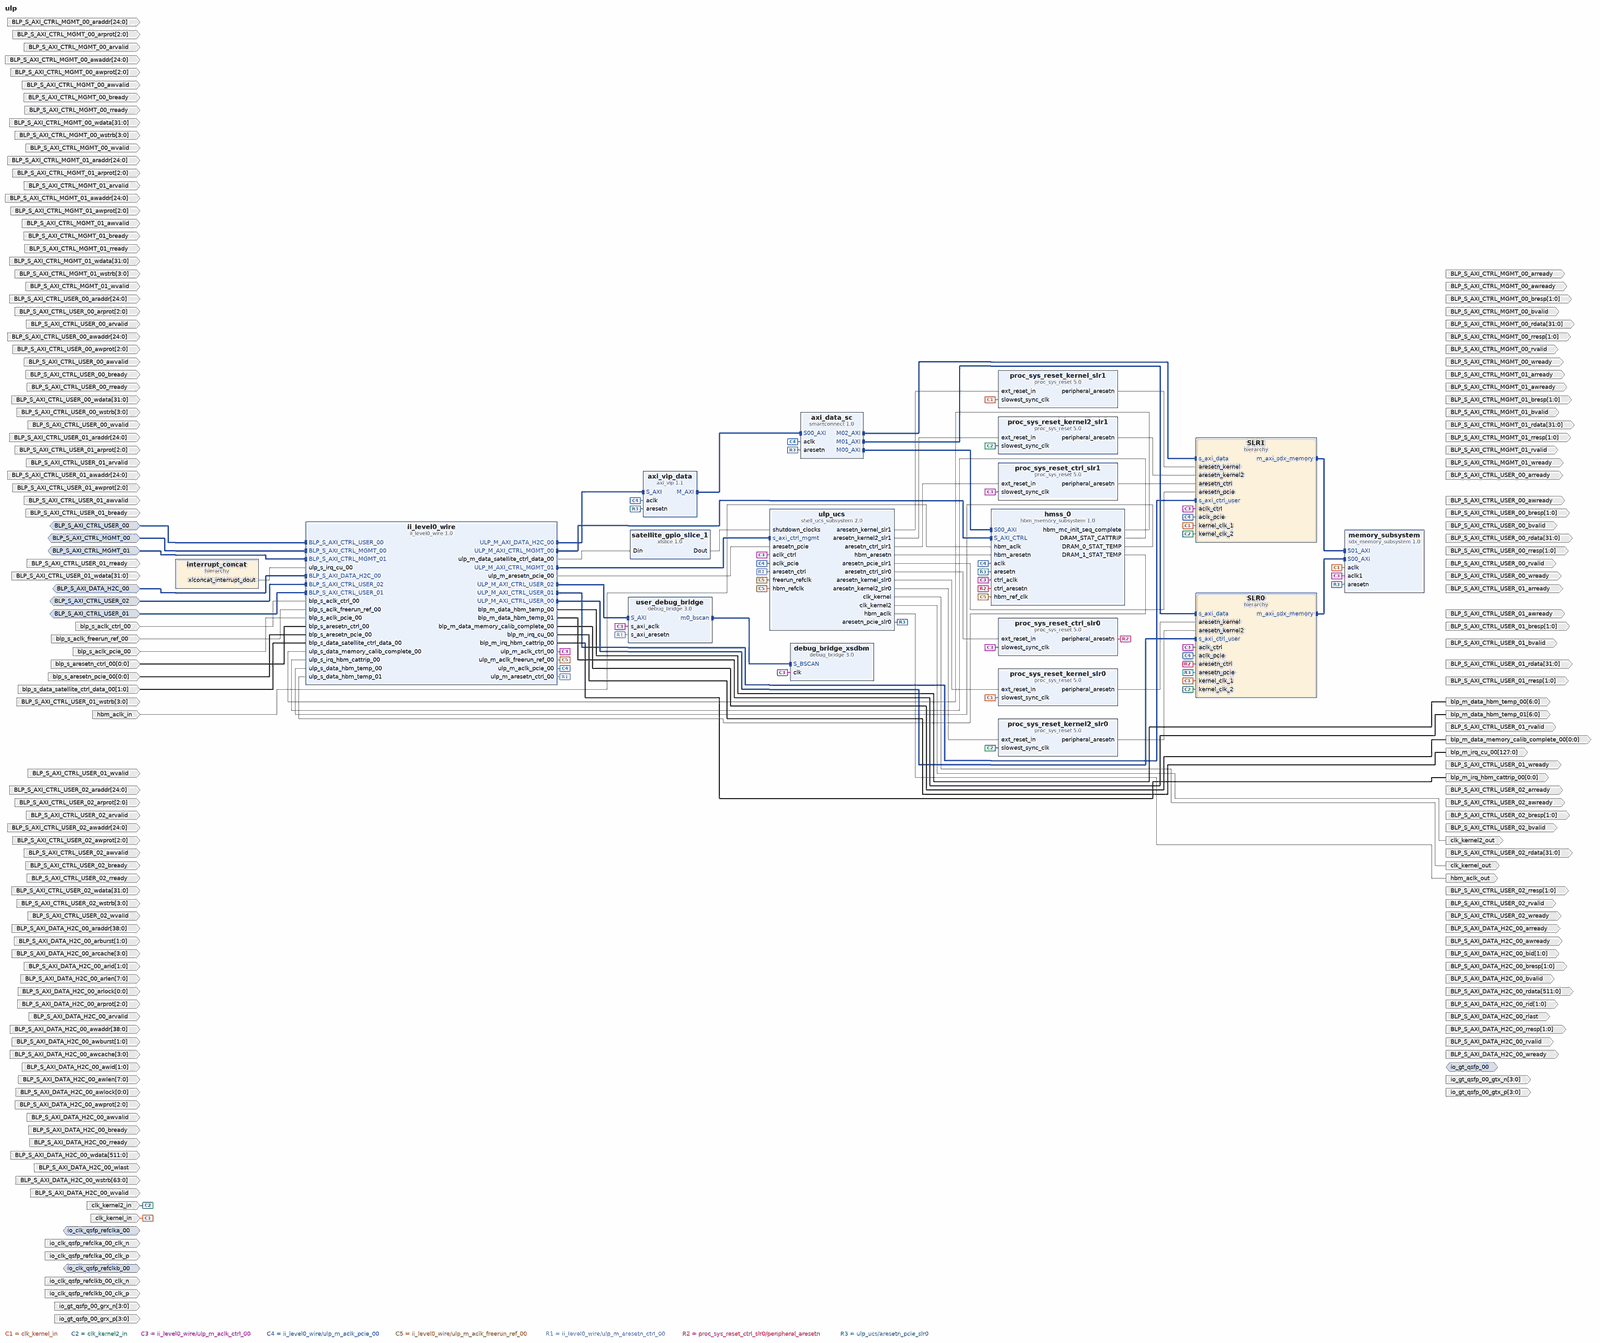
[diagram p0: block diagram of the top level, whole]
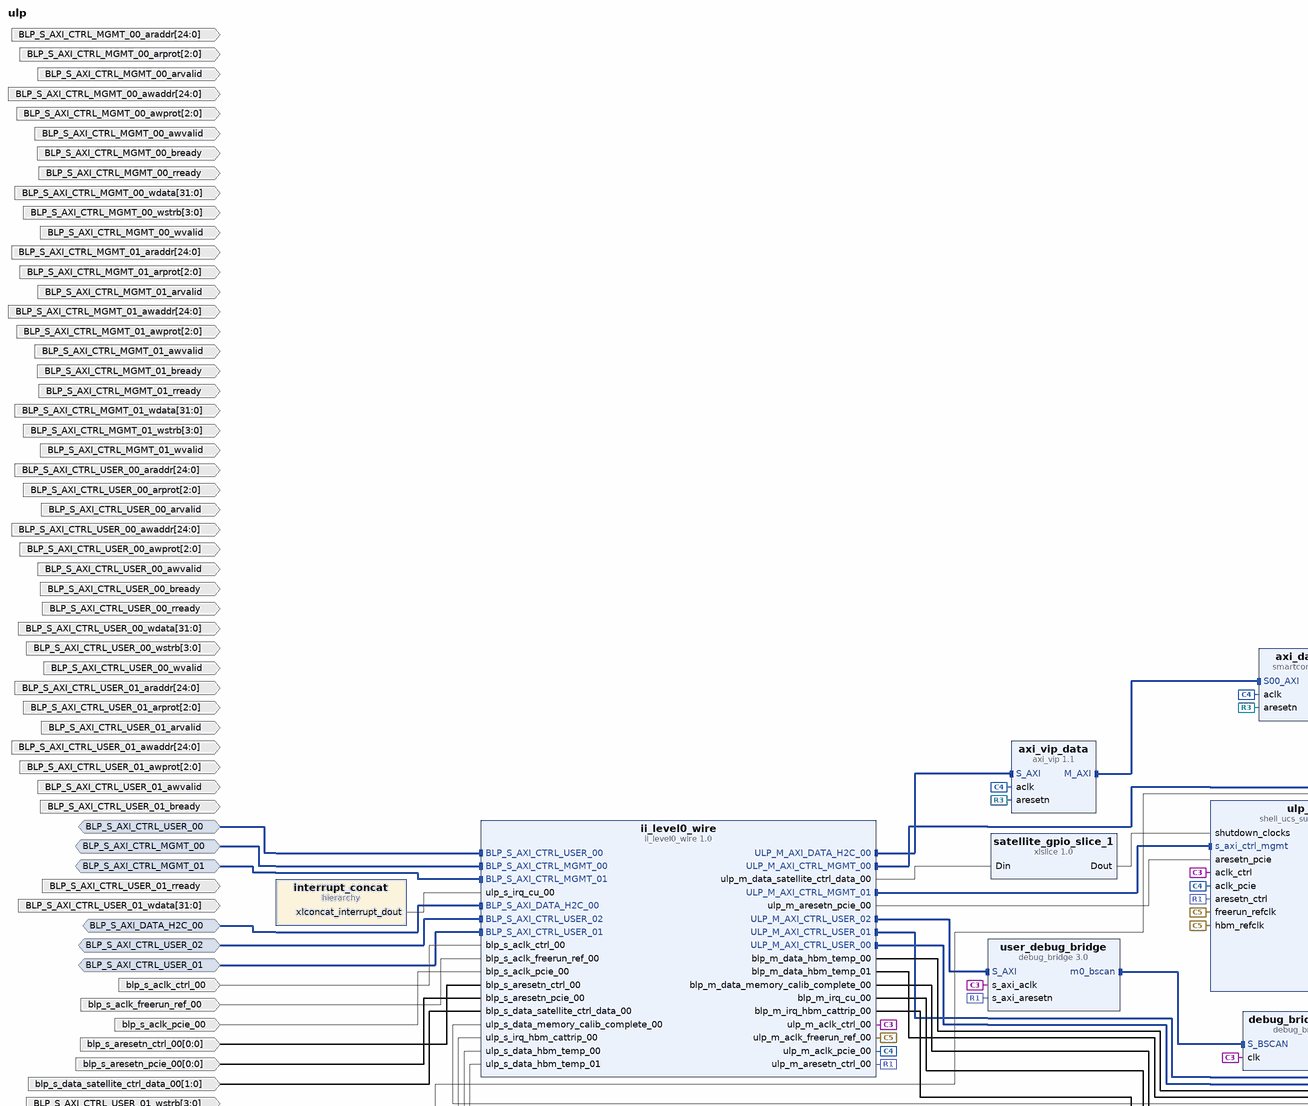
[diagram p1: block diagram of the top level, upper left part]
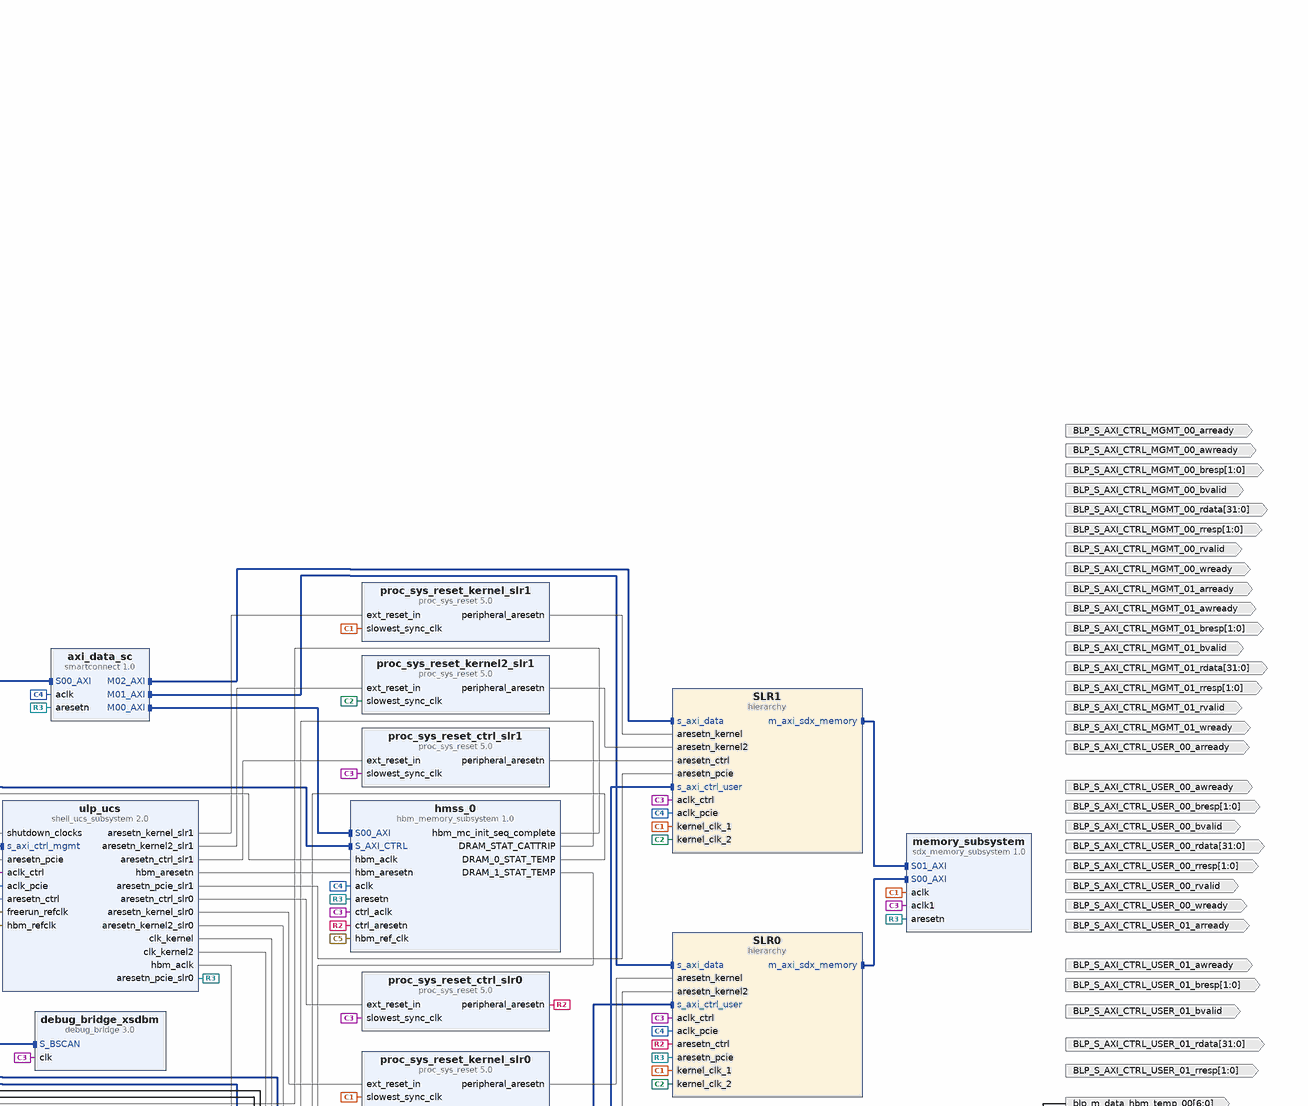
[diagram p2: block diagram of the top level, upper right part]
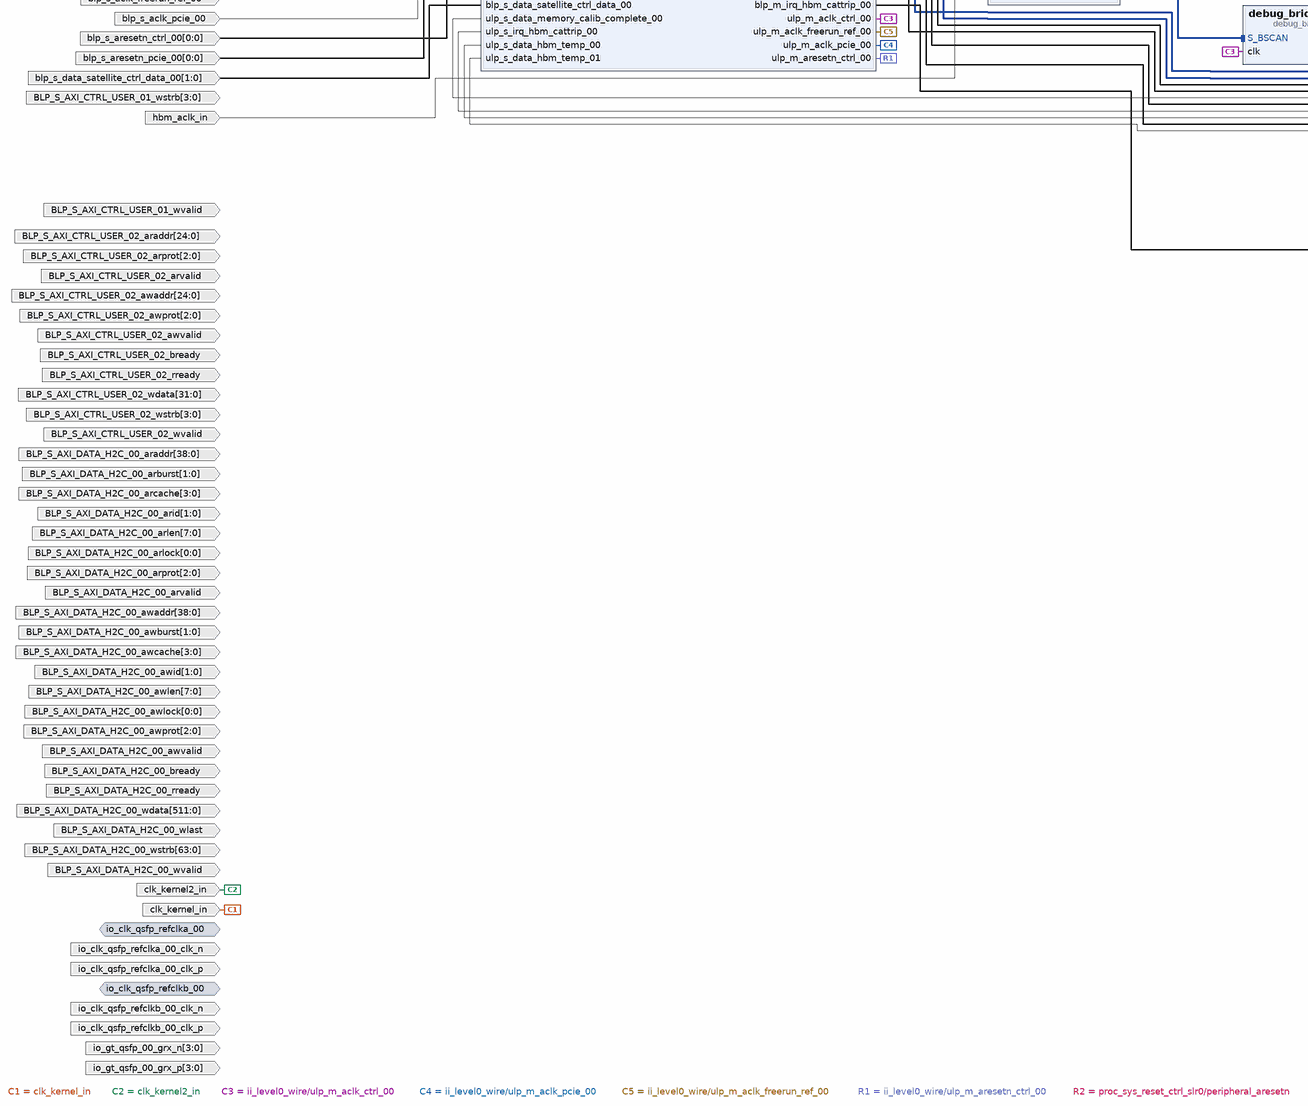
[diagram p3: block diagram of the top level, lower left part]
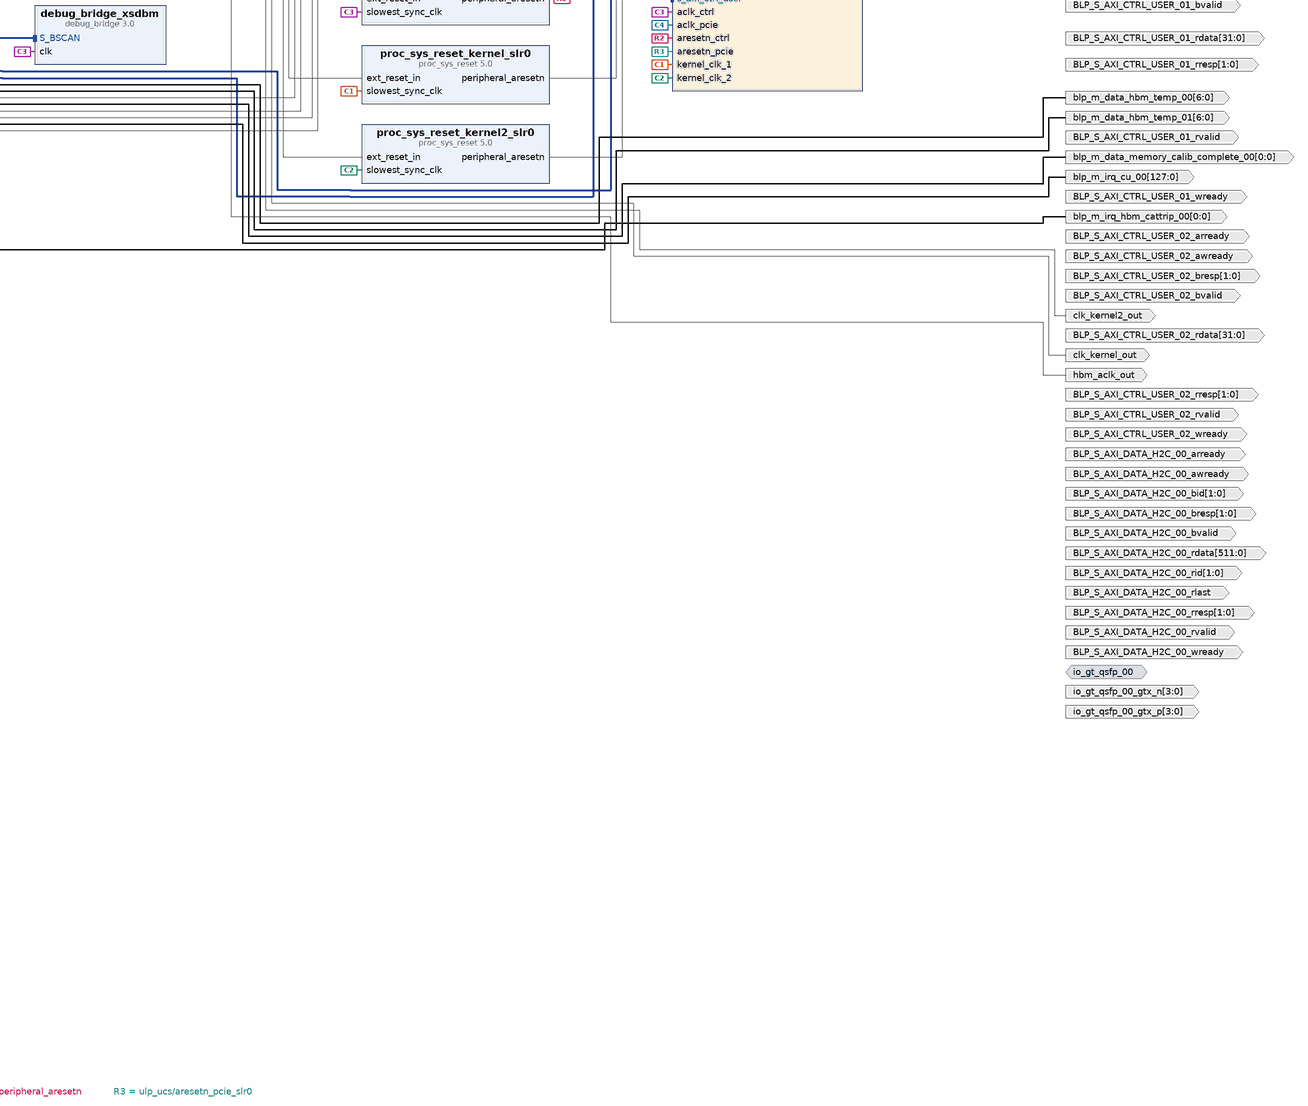
[diagram p4: block diagram of the top level, lower right part]
# Vivado block design ulp, xcu50-fsvh2104-2-e, Vivado 2019.2
create_bd_design ulp

create_bd_intf_port -mode Master -vlnv xilinx.com:interface:gt_rtl:1.0 io_gt_qsfp_00
create_bd_intf_port -mode Slave -vlnv xilinx.com:interface:diff_clock_rtl:1.0 io_clk_qsfp_refclka_00
create_bd_intf_port -mode Slave -vlnv xilinx.com:interface:diff_clock_rtl:1.0 io_clk_qsfp_refclkb_00
create_bd_intf_port -mode Slave -vlnv xilinx.com:interface:aximm_rtl:1.0 BLP_S_AXI_CTRL_MGMT_00
set_property -dict [list \
  CONFIG.DATA_WIDTH 32 \
  CONFIG.PROTOCOL AXI4LITE \
  CONFIG.FREQ_HZ 50000000 \
  CONFIG.ID_WIDTH 0 \
  CONFIG.ADDR_WIDTH 25 \
  CONFIG.AWUSER_WIDTH 0 \
  CONFIG.ARUSER_WIDTH 0 \
  CONFIG.WUSER_WIDTH 0 \
  CONFIG.RUSER_WIDTH 0 \
  CONFIG.BUSER_WIDTH 0 \
  CONFIG.READ_WRITE_MODE READ_WRITE \
  CONFIG.HAS_BURST 0 \
  CONFIG.HAS_LOCK 0 \
  CONFIG.HAS_PROT 1 \
  CONFIG.HAS_CACHE 0 \
  CONFIG.HAS_QOS 0 \
  CONFIG.HAS_REGION 0 \
  CONFIG.HAS_WSTRB 1 \
  CONFIG.HAS_BRESP 1 \
  CONFIG.HAS_RRESP 1 \
  CONFIG.SUPPORTS_NARROW_BURST 0 \
  CONFIG.NUM_READ_OUTSTANDING 2 \
  CONFIG.NUM_WRITE_OUTSTANDING 2 \
  CONFIG.MAX_BURST_LENGTH 1 \
  CONFIG.PHASE 0 \
  CONFIG.CLK_DOMAIN cd_ctrl_00 \
  CONFIG.NUM_READ_THREADS 1 \
  CONFIG.NUM_WRITE_THREADS 1 \
  CONFIG.RUSER_BITS_PER_BYTE 0 \
  CONFIG.WUSER_BITS_PER_BYTE 0 \
] [get_bd_intf_ports BLP_S_AXI_CTRL_MGMT_00]
create_bd_intf_port -mode Slave -vlnv xilinx.com:interface:aximm_rtl:1.0 BLP_S_AXI_CTRL_MGMT_01
set_property -dict [list \
  CONFIG.DATA_WIDTH 32 \
  CONFIG.PROTOCOL AXI4LITE \
  CONFIG.FREQ_HZ 50000000 \
  CONFIG.ID_WIDTH 0 \
  CONFIG.ADDR_WIDTH 25 \
  CONFIG.AWUSER_WIDTH 0 \
  CONFIG.ARUSER_WIDTH 0 \
  CONFIG.WUSER_WIDTH 0 \
  CONFIG.RUSER_WIDTH 0 \
  CONFIG.BUSER_WIDTH 0 \
  CONFIG.READ_WRITE_MODE READ_WRITE \
  CONFIG.HAS_BURST 0 \
  CONFIG.HAS_LOCK 0 \
  CONFIG.HAS_PROT 1 \
  CONFIG.HAS_CACHE 0 \
  CONFIG.HAS_QOS 0 \
  CONFIG.HAS_REGION 0 \
  CONFIG.HAS_WSTRB 1 \
  CONFIG.HAS_BRESP 1 \
  CONFIG.HAS_RRESP 1 \
  CONFIG.SUPPORTS_NARROW_BURST 0 \
  CONFIG.NUM_READ_OUTSTANDING 2 \
  CONFIG.NUM_WRITE_OUTSTANDING 2 \
  CONFIG.MAX_BURST_LENGTH 1 \
  CONFIG.PHASE 0 \
  CONFIG.CLK_DOMAIN cd_ctrl_00 \
  CONFIG.NUM_READ_THREADS 1 \
  CONFIG.NUM_WRITE_THREADS 1 \
  CONFIG.RUSER_BITS_PER_BYTE 0 \
  CONFIG.WUSER_BITS_PER_BYTE 0 \
] [get_bd_intf_ports BLP_S_AXI_CTRL_MGMT_01]
create_bd_intf_port -mode Slave -vlnv xilinx.com:interface:aximm_rtl:1.0 BLP_S_AXI_CTRL_USER_00
set_property -dict [list \
  CONFIG.DATA_WIDTH 32 \
  CONFIG.PROTOCOL AXI4LITE \
  CONFIG.FREQ_HZ 50000000 \
  CONFIG.ID_WIDTH 0 \
  CONFIG.ADDR_WIDTH 25 \
  CONFIG.AWUSER_WIDTH 0 \
  CONFIG.ARUSER_WIDTH 0 \
  CONFIG.WUSER_WIDTH 0 \
  CONFIG.RUSER_WIDTH 0 \
  CONFIG.BUSER_WIDTH 0 \
  CONFIG.READ_WRITE_MODE READ_WRITE \
  CONFIG.HAS_BURST 0 \
  CONFIG.HAS_LOCK 0 \
  CONFIG.HAS_PROT 1 \
  CONFIG.HAS_CACHE 0 \
  CONFIG.HAS_QOS 0 \
  CONFIG.HAS_REGION 0 \
  CONFIG.HAS_WSTRB 1 \
  CONFIG.HAS_BRESP 1 \
  CONFIG.HAS_RRESP 1 \
  CONFIG.SUPPORTS_NARROW_BURST 0 \
  CONFIG.NUM_READ_OUTSTANDING 2 \
  CONFIG.NUM_WRITE_OUTSTANDING 2 \
  CONFIG.MAX_BURST_LENGTH 1 \
  CONFIG.PHASE 0 \
  CONFIG.CLK_DOMAIN cd_ctrl_00 \
  CONFIG.NUM_READ_THREADS 1 \
  CONFIG.NUM_WRITE_THREADS 1 \
  CONFIG.RUSER_BITS_PER_BYTE 0 \
  CONFIG.WUSER_BITS_PER_BYTE 0 \
] [get_bd_intf_ports BLP_S_AXI_CTRL_USER_00]
create_bd_intf_port -mode Slave -vlnv xilinx.com:interface:aximm_rtl:1.0 BLP_S_AXI_CTRL_USER_01
set_property -dict [list \
  CONFIG.DATA_WIDTH 32 \
  CONFIG.PROTOCOL AXI4LITE \
  CONFIG.FREQ_HZ 50000000 \
  CONFIG.ID_WIDTH 0 \
  CONFIG.ADDR_WIDTH 25 \
  CONFIG.AWUSER_WIDTH 0 \
  CONFIG.ARUSER_WIDTH 0 \
  CONFIG.WUSER_WIDTH 0 \
  CONFIG.RUSER_WIDTH 0 \
  CONFIG.BUSER_WIDTH 0 \
  CONFIG.READ_WRITE_MODE READ_WRITE \
  CONFIG.HAS_BURST 0 \
  CONFIG.HAS_LOCK 0 \
  CONFIG.HAS_PROT 1 \
  CONFIG.HAS_CACHE 0 \
  CONFIG.HAS_QOS 0 \
  CONFIG.HAS_REGION 0 \
  CONFIG.HAS_WSTRB 1 \
  CONFIG.HAS_BRESP 1 \
  CONFIG.HAS_RRESP 1 \
  CONFIG.SUPPORTS_NARROW_BURST 0 \
  CONFIG.NUM_READ_OUTSTANDING 2 \
  CONFIG.NUM_WRITE_OUTSTANDING 2 \
  CONFIG.MAX_BURST_LENGTH 1 \
  CONFIG.PHASE 0 \
  CONFIG.CLK_DOMAIN cd_ctrl_00 \
  CONFIG.NUM_READ_THREADS 1 \
  CONFIG.NUM_WRITE_THREADS 1 \
  CONFIG.RUSER_BITS_PER_BYTE 0 \
  CONFIG.WUSER_BITS_PER_BYTE 0 \
] [get_bd_intf_ports BLP_S_AXI_CTRL_USER_01]
create_bd_intf_port -mode Slave -vlnv xilinx.com:interface:aximm_rtl:1.0 BLP_S_AXI_CTRL_USER_02
set_property -dict [list \
  CONFIG.DATA_WIDTH 32 \
  CONFIG.PROTOCOL AXI4LITE \
  CONFIG.FREQ_HZ 50000000 \
  CONFIG.ID_WIDTH 0 \
  CONFIG.ADDR_WIDTH 25 \
  CONFIG.AWUSER_WIDTH 0 \
  CONFIG.ARUSER_WIDTH 0 \
  CONFIG.WUSER_WIDTH 0 \
  CONFIG.RUSER_WIDTH 0 \
  CONFIG.BUSER_WIDTH 0 \
  CONFIG.READ_WRITE_MODE READ_WRITE \
  CONFIG.HAS_BURST 0 \
  CONFIG.HAS_LOCK 0 \
  CONFIG.HAS_PROT 1 \
  CONFIG.HAS_CACHE 0 \
  CONFIG.HAS_QOS 0 \
  CONFIG.HAS_REGION 0 \
  CONFIG.HAS_WSTRB 1 \
  CONFIG.HAS_BRESP 1 \
  CONFIG.HAS_RRESP 1 \
  CONFIG.SUPPORTS_NARROW_BURST 0 \
  CONFIG.NUM_READ_OUTSTANDING 2 \
  CONFIG.NUM_WRITE_OUTSTANDING 2 \
  CONFIG.MAX_BURST_LENGTH 1 \
  CONFIG.PHASE 0 \
  CONFIG.CLK_DOMAIN cd_ctrl_00 \
  CONFIG.NUM_READ_THREADS 1 \
  CONFIG.NUM_WRITE_THREADS 1 \
  CONFIG.RUSER_BITS_PER_BYTE 0 \
  CONFIG.WUSER_BITS_PER_BYTE 0 \
] [get_bd_intf_ports BLP_S_AXI_CTRL_USER_02]
create_bd_intf_port -mode Slave -vlnv xilinx.com:interface:aximm_rtl:1.0 BLP_S_AXI_DATA_H2C_00
set_property -dict [list \
  CONFIG.DATA_WIDTH 512 \
  CONFIG.PROTOCOL AXI4 \
  CONFIG.FREQ_HZ 250000000 \
  CONFIG.ID_WIDTH 2 \
  CONFIG.ADDR_WIDTH 39 \
  CONFIG.AWUSER_WIDTH 0 \
  CONFIG.ARUSER_WIDTH 0 \
  CONFIG.WUSER_WIDTH 0 \
  CONFIG.RUSER_WIDTH 0 \
  CONFIG.BUSER_WIDTH 0 \
  CONFIG.READ_WRITE_MODE READ_WRITE \
  CONFIG.HAS_BURST 1 \
  CONFIG.HAS_LOCK 1 \
  CONFIG.HAS_PROT 1 \
  CONFIG.HAS_CACHE 1 \
  CONFIG.HAS_QOS 0 \
  CONFIG.HAS_REGION 0 \
  CONFIG.HAS_WSTRB 1 \
  CONFIG.HAS_BRESP 1 \
  CONFIG.HAS_RRESP 1 \
  CONFIG.SUPPORTS_NARROW_BURST 0 \
  CONFIG.NUM_READ_OUTSTANDING 16 \
  CONFIG.NUM_WRITE_OUTSTANDING 16 \
  CONFIG.MAX_BURST_LENGTH 256 \
  CONFIG.PHASE 0 \
  CONFIG.CLK_DOMAIN cd_pcie_00 \
  CONFIG.NUM_READ_THREADS 2 \
  CONFIG.NUM_WRITE_THREADS 2 \
  CONFIG.RUSER_BITS_PER_BYTE 0 \
  CONFIG.WUSER_BITS_PER_BYTE 0 \
] [get_bd_intf_ports BLP_S_AXI_DATA_H2C_00]
create_bd_port -dir O -from 3 -to 0 io_gt_qsfp_00_gtx_n
create_bd_port -dir O -from 3 -to 0 io_gt_qsfp_00_gtx_p
create_bd_port -dir I -from 3 -to 0 io_gt_qsfp_00_grx_n
create_bd_port -dir I -from 3 -to 0 io_gt_qsfp_00_grx_p
create_bd_port -dir I io_clk_qsfp_refclka_00_clk_p
create_bd_port -dir I io_clk_qsfp_refclka_00_clk_n
create_bd_port -dir I io_clk_qsfp_refclkb_00_clk_p
create_bd_port -dir I io_clk_qsfp_refclkb_00_clk_n
create_bd_port -dir O -from 6 -to 0 -type data blp_m_data_hbm_temp_00
create_bd_port -dir O -from 6 -to 0 -type data blp_m_data_hbm_temp_01
create_bd_port -dir O -from 0 -to 0 -type data blp_m_data_memory_calib_complete_00
create_bd_port -dir O -from 127 -to 0 -type intr blp_m_irq_cu_00
create_bd_port -dir O -from 0 -to 0 -type intr blp_m_irq_hbm_cattrip_00
create_bd_port -dir I -type clk blp_s_aclk_ctrl_00
set_property -dict {CONFIG.CLK_DOMAIN cd_ctrl_00 CONFIG.FREQ_HZ 50000000 CONFIG.PHASE 0} [get_bd_ports blp_s_aclk_ctrl_00]
create_bd_port -dir I -type clk blp_s_aclk_freerun_ref_00
set_property -dict [list \
  CONFIG.CLK_DOMAIN cd_freerun_ref_00 \
  CONFIG.FREQ_HZ 100000000 \
  CONFIG.PHASE 0 \
] [get_bd_ports blp_s_aclk_freerun_ref_00]
create_bd_port -dir I -type clk blp_s_aclk_pcie_00
set_property -dict {CONFIG.CLK_DOMAIN cd_pcie_00 CONFIG.FREQ_HZ 250000000 CONFIG.PHASE 0} [get_bd_ports blp_s_aclk_pcie_00]
create_bd_port -dir I -from 0 -to 0 -type rst blp_s_aresetn_ctrl_00
create_bd_port -dir I -from 0 -to 0 -type rst blp_s_aresetn_pcie_00
create_bd_port -dir I -from 1 -to 0 -type data blp_s_data_satellite_ctrl_data_00
create_bd_port -dir O -type clk clk_kernel_out
set_property -dict {CONFIG.FREQ_HZ 300000000} [get_bd_ports clk_kernel_out]
create_bd_port -dir O -type clk clk_kernel2_out
set_property -dict {CONFIG.FREQ_HZ 500000000} [get_bd_ports clk_kernel2_out]
create_bd_port -dir I -type clk clk_kernel_in
set_property -dict {CONFIG.FREQ_HZ 300000000} [get_bd_ports clk_kernel_in]
create_bd_port -dir I -type clk clk_kernel2_in
set_property -dict {CONFIG.FREQ_HZ 500000000} [get_bd_ports clk_kernel2_in]
create_bd_port -dir O -type clk hbm_aclk_out
set_property -dict {CONFIG.FREQ_HZ 450000000} [get_bd_ports hbm_aclk_out]
create_bd_port -dir I -type clk hbm_aclk_in
set_property -dict {CONFIG.FREQ_HZ 450000000} [get_bd_ports hbm_aclk_in]
create_bd_port -dir I -from 24 -to 0 BLP_S_AXI_CTRL_MGMT_00_araddr
create_bd_port -dir I -from 2 -to 0 BLP_S_AXI_CTRL_MGMT_00_arprot
create_bd_port -dir O BLP_S_AXI_CTRL_MGMT_00_arready
create_bd_port -dir I BLP_S_AXI_CTRL_MGMT_00_arvalid
create_bd_port -dir I -from 24 -to 0 BLP_S_AXI_CTRL_MGMT_00_awaddr
create_bd_port -dir I -from 2 -to 0 BLP_S_AXI_CTRL_MGMT_00_awprot
create_bd_port -dir O BLP_S_AXI_CTRL_MGMT_00_awready
create_bd_port -dir I BLP_S_AXI_CTRL_MGMT_00_awvalid
create_bd_port -dir I BLP_S_AXI_CTRL_MGMT_00_bready
create_bd_port -dir O -from 1 -to 0 BLP_S_AXI_CTRL_MGMT_00_bresp
create_bd_port -dir O BLP_S_AXI_CTRL_MGMT_00_bvalid
create_bd_port -dir O -from 31 -to 0 BLP_S_AXI_CTRL_MGMT_00_rdata
create_bd_port -dir I BLP_S_AXI_CTRL_MGMT_00_rready
create_bd_port -dir O -from 1 -to 0 BLP_S_AXI_CTRL_MGMT_00_rresp
create_bd_port -dir O BLP_S_AXI_CTRL_MGMT_00_rvalid
create_bd_port -dir I -from 31 -to 0 BLP_S_AXI_CTRL_MGMT_00_wdata
create_bd_port -dir O BLP_S_AXI_CTRL_MGMT_00_wready
create_bd_port -dir I -from 3 -to 0 BLP_S_AXI_CTRL_MGMT_00_wstrb
create_bd_port -dir I BLP_S_AXI_CTRL_MGMT_00_wvalid
create_bd_port -dir I -from 24 -to 0 BLP_S_AXI_CTRL_MGMT_01_araddr
create_bd_port -dir I -from 2 -to 0 BLP_S_AXI_CTRL_MGMT_01_arprot
create_bd_port -dir O BLP_S_AXI_CTRL_MGMT_01_arready
create_bd_port -dir I BLP_S_AXI_CTRL_MGMT_01_arvalid
create_bd_port -dir I -from 24 -to 0 BLP_S_AXI_CTRL_MGMT_01_awaddr
create_bd_port -dir I -from 2 -to 0 BLP_S_AXI_CTRL_MGMT_01_awprot
create_bd_port -dir O BLP_S_AXI_CTRL_MGMT_01_awready
create_bd_port -dir I BLP_S_AXI_CTRL_MGMT_01_awvalid
create_bd_port -dir I BLP_S_AXI_CTRL_MGMT_01_bready
create_bd_port -dir O -from 1 -to 0 BLP_S_AXI_CTRL_MGMT_01_bresp
create_bd_port -dir O BLP_S_AXI_CTRL_MGMT_01_bvalid
create_bd_port -dir O -from 31 -to 0 BLP_S_AXI_CTRL_MGMT_01_rdata
create_bd_port -dir I BLP_S_AXI_CTRL_MGMT_01_rready
create_bd_port -dir O -from 1 -to 0 BLP_S_AXI_CTRL_MGMT_01_rresp
create_bd_port -dir O BLP_S_AXI_CTRL_MGMT_01_rvalid
create_bd_port -dir I -from 31 -to 0 BLP_S_AXI_CTRL_MGMT_01_wdata
create_bd_port -dir O BLP_S_AXI_CTRL_MGMT_01_wready
create_bd_port -dir I -from 3 -to 0 BLP_S_AXI_CTRL_MGMT_01_wstrb
create_bd_port -dir I BLP_S_AXI_CTRL_MGMT_01_wvalid
create_bd_port -dir I -from 24 -to 0 BLP_S_AXI_CTRL_USER_00_araddr
create_bd_port -dir I -from 2 -to 0 BLP_S_AXI_CTRL_USER_00_arprot
create_bd_port -dir O BLP_S_AXI_CTRL_USER_00_arready
create_bd_port -dir I BLP_S_AXI_CTRL_USER_00_arvalid
create_bd_port -dir I -from 24 -to 0 BLP_S_AXI_CTRL_USER_00_awaddr
create_bd_port -dir I -from 2 -to 0 BLP_S_AXI_CTRL_USER_00_awprot
create_bd_port -dir O BLP_S_AXI_CTRL_USER_00_awready
create_bd_port -dir I BLP_S_AXI_CTRL_USER_00_awvalid
create_bd_port -dir I BLP_S_AXI_CTRL_USER_00_bready
create_bd_port -dir O -from 1 -to 0 BLP_S_AXI_CTRL_USER_00_bresp
create_bd_port -dir O BLP_S_AXI_CTRL_USER_00_bvalid
create_bd_port -dir O -from 31 -to 0 BLP_S_AXI_CTRL_USER_00_rdata
create_bd_port -dir I BLP_S_AXI_CTRL_USER_00_rready
create_bd_port -dir O -from 1 -to 0 BLP_S_AXI_CTRL_USER_00_rresp
create_bd_port -dir O BLP_S_AXI_CTRL_USER_00_rvalid
create_bd_port -dir I -from 31 -to 0 BLP_S_AXI_CTRL_USER_00_wdata
create_bd_port -dir O BLP_S_AXI_CTRL_USER_00_wready
create_bd_port -dir I -from 3 -to 0 BLP_S_AXI_CTRL_USER_00_wstrb
create_bd_port -dir I BLP_S_AXI_CTRL_USER_00_wvalid
create_bd_port -dir I -from 24 -to 0 BLP_S_AXI_CTRL_USER_01_araddr
create_bd_port -dir I -from 2 -to 0 BLP_S_AXI_CTRL_USER_01_arprot
create_bd_port -dir O BLP_S_AXI_CTRL_USER_01_arready
create_bd_port -dir I BLP_S_AXI_CTRL_USER_01_arvalid
create_bd_port -dir I -from 24 -to 0 BLP_S_AXI_CTRL_USER_01_awaddr
create_bd_port -dir I -from 2 -to 0 BLP_S_AXI_CTRL_USER_01_awprot
create_bd_port -dir O BLP_S_AXI_CTRL_USER_01_awready
create_bd_port -dir I BLP_S_AXI_CTRL_USER_01_awvalid
create_bd_port -dir I BLP_S_AXI_CTRL_USER_01_bready
create_bd_port -dir O -from 1 -to 0 BLP_S_AXI_CTRL_USER_01_bresp
create_bd_port -dir O BLP_S_AXI_CTRL_USER_01_bvalid
create_bd_port -dir O -from 31 -to 0 BLP_S_AXI_CTRL_USER_01_rdata
create_bd_port -dir I BLP_S_AXI_CTRL_USER_01_rready
create_bd_port -dir O -from 1 -to 0 BLP_S_AXI_CTRL_USER_01_rresp
create_bd_port -dir O BLP_S_AXI_CTRL_USER_01_rvalid
create_bd_port -dir I -from 31 -to 0 BLP_S_AXI_CTRL_USER_01_wdata
create_bd_port -dir O BLP_S_AXI_CTRL_USER_01_wready
create_bd_port -dir I -from 3 -to 0 BLP_S_AXI_CTRL_USER_01_wstrb
create_bd_port -dir I BLP_S_AXI_CTRL_USER_01_wvalid
create_bd_port -dir I -from 24 -to 0 BLP_S_AXI_CTRL_USER_02_araddr
create_bd_port -dir I -from 2 -to 0 BLP_S_AXI_CTRL_USER_02_arprot
create_bd_port -dir O BLP_S_AXI_CTRL_USER_02_arready
create_bd_port -dir I BLP_S_AXI_CTRL_USER_02_arvalid
create_bd_port -dir I -from 24 -to 0 BLP_S_AXI_CTRL_USER_02_awaddr
create_bd_port -dir I -from 2 -to 0 BLP_S_AXI_CTRL_USER_02_awprot
create_bd_port -dir O BLP_S_AXI_CTRL_USER_02_awready
create_bd_port -dir I BLP_S_AXI_CTRL_USER_02_awvalid
create_bd_port -dir I BLP_S_AXI_CTRL_USER_02_bready
create_bd_port -dir O -from 1 -to 0 BLP_S_AXI_CTRL_USER_02_bresp
create_bd_port -dir O BLP_S_AXI_CTRL_USER_02_bvalid
create_bd_port -dir O -from 31 -to 0 BLP_S_AXI_CTRL_USER_02_rdata
create_bd_port -dir I BLP_S_AXI_CTRL_USER_02_rready
create_bd_port -dir O -from 1 -to 0 BLP_S_AXI_CTRL_USER_02_rresp
create_bd_port -dir O BLP_S_AXI_CTRL_USER_02_rvalid
create_bd_port -dir I -from 31 -to 0 BLP_S_AXI_CTRL_USER_02_wdata
create_bd_port -dir O BLP_S_AXI_CTRL_USER_02_wready
create_bd_port -dir I -from 3 -to 0 BLP_S_AXI_CTRL_USER_02_wstrb
create_bd_port -dir I BLP_S_AXI_CTRL_USER_02_wvalid
create_bd_port -dir I -from 38 -to 0 BLP_S_AXI_DATA_H2C_00_araddr
create_bd_port -dir I -from 1 -to 0 BLP_S_AXI_DATA_H2C_00_arburst
create_bd_port -dir I -from 3 -to 0 BLP_S_AXI_DATA_H2C_00_arcache
create_bd_port -dir I -from 7 -to 0 BLP_S_AXI_DATA_H2C_00_arlen
create_bd_port -dir I -from 0 -to 0 BLP_S_AXI_DATA_H2C_00_arlock
create_bd_port -dir I -from 2 -to 0 BLP_S_AXI_DATA_H2C_00_arprot
create_bd_port -dir O BLP_S_AXI_DATA_H2C_00_arready
create_bd_port -dir I BLP_S_AXI_DATA_H2C_00_arvalid
create_bd_port -dir I -from 38 -to 0 BLP_S_AXI_DATA_H2C_00_awaddr
create_bd_port -dir I -from 1 -to 0 BLP_S_AXI_DATA_H2C_00_awburst
create_bd_port -dir I -from 3 -to 0 BLP_S_AXI_DATA_H2C_00_awcache
create_bd_port -dir I -from 7 -to 0 BLP_S_AXI_DATA_H2C_00_awlen
create_bd_port -dir I -from 0 -to 0 BLP_S_AXI_DATA_H2C_00_awlock
create_bd_port -dir I -from 2 -to 0 BLP_S_AXI_DATA_H2C_00_awprot
create_bd_port -dir O BLP_S_AXI_DATA_H2C_00_awready
create_bd_port -dir I BLP_S_AXI_DATA_H2C_00_awvalid
create_bd_port -dir I BLP_S_AXI_DATA_H2C_00_bready
create_bd_port -dir O -from 1 -to 0 BLP_S_AXI_DATA_H2C_00_bresp
create_bd_port -dir O BLP_S_AXI_DATA_H2C_00_bvalid
create_bd_port -dir O -from 511 -to 0 BLP_S_AXI_DATA_H2C_00_rdata
create_bd_port -dir O BLP_S_AXI_DATA_H2C_00_rlast
create_bd_port -dir I BLP_S_AXI_DATA_H2C_00_rready
create_bd_port -dir O -from 1 -to 0 BLP_S_AXI_DATA_H2C_00_rresp
create_bd_port -dir O BLP_S_AXI_DATA_H2C_00_rvalid
create_bd_port -dir I -from 511 -to 0 BLP_S_AXI_DATA_H2C_00_wdata
create_bd_port -dir I BLP_S_AXI_DATA_H2C_00_wlast
create_bd_port -dir O BLP_S_AXI_DATA_H2C_00_wready
create_bd_port -dir I -from 63 -to 0 BLP_S_AXI_DATA_H2C_00_wstrb
create_bd_port -dir I BLP_S_AXI_DATA_H2C_00_wvalid
create_bd_port -dir I -from 1 -to 0 BLP_S_AXI_DATA_H2C_00_arid
create_bd_port -dir I -from 1 -to 0 BLP_S_AXI_DATA_H2C_00_awid
create_bd_port -dir O -from 1 -to 0 BLP_S_AXI_DATA_H2C_00_bid
create_bd_port -dir O -from 1 -to 0 BLP_S_AXI_DATA_H2C_00_rid

create_bd_cell -type ip -vlnv xilinx.com:ip:ii_level0_wire:1.0 ii_level0_wire
create_bd_cell -type ip -vlnv xilinx.com:ip:debug_bridge:3.0 user_debug_bridge
set_property -dict [list \
  CONFIG.C_DEBUG_MODE 2 \
  CONFIG.C_DESIGN_TYPE 1 \
  CONFIG.C_ENABLE_CLK_DIVIDER false \
  CONFIG.C_NUM_BS_MASTER 1 \
] [get_bd_cells user_debug_bridge]
create_bd_cell -type ip -vlnv xilinx.com:ip:debug_bridge:3.0 debug_bridge_xsdbm
set_property -dict [list \
  CONFIG.C_DEBUG_MODE 1 \
  CONFIG.C_DESIGN_TYPE 1 \
  CONFIG.C_ENABLE_CLK_DIVIDER false \
] [get_bd_cells debug_bridge_xsdbm]
create_bd_cell -type ip -vlnv xilinx.com:ip:sdx_memory_subsystem:1.0 memory_subsystem
set_property -dict [list \
  CONFIG.ADVANCED_PROPERTIES {resource_access_constraints {S00_AXI { PLRAM_MEM00 PLRAM_MEM01 } S01_AXI {PLRAM_MEM02 PLRAM_MEM03 }}  resource_map_replication { S00_AXI {} S01_AXI {}} plram_specifications {  { SIZE 128K AXI_DATA_WIDTH 128 SLR_ASSIGNMENT SLR0 }  { SIZE 128K AXI_DATA_WIDTH 128 SLR_ASSIGNMENT SLR0 }  { SIZE 128K AXI_DATA_WIDTH 128 SLR_ASSIGNMENT SLR1 }  { SIZE 128K AXI_DATA_WIDTH 128 SLR_ASSIGNMENT SLR1 } }  } \
  CONFIG.NUM_CLKS 2 \
  CONFIG.NUM_SI 2 \
] [get_bd_cells memory_subsystem]
create_bd_cell -type ip -vlnv xilinx.com:ip:hbm_memory_subsystem:1.0 hmss_0
set_property -dict [list \
  CONFIG.ADVANCED_PROPERTIES {NULL NULL HBM_PORT_PROHIBIT {S30_AXI S31_AXI} HBM_STAGED_CALIBRATION true} \
  CONFIG.DISABLE_HBM_REF_CLK_BUFG true \
  CONFIG.S00_SLR SLR0 \
] [get_bd_cells hmss_0]
create_bd_cell -type ip -vlnv xilinx.com:ip:axi_vip:1.1 axi_vip_data
create_bd_cell -type ip -vlnv xilinx.com:ip:smartconnect:1.0 axi_data_sc
set_property -dict {CONFIG.NUM_MI 3 CONFIG.NUM_SI 1} [get_bd_cells axi_data_sc]
create_bd_cell -type ip -vlnv xilinx.com:ip:xlslice:1.0 satellite_gpio_slice_1
set_property -dict [list \
  CONFIG.DIN_FROM 1 \
  CONFIG.DIN_TO 1 \
  CONFIG.DIN_WIDTH 2 \
  CONFIG.DOUT_WIDTH 1 \
] [get_bd_cells satellite_gpio_slice_1]
create_bd_cell -type ip -vlnv xilinx.com:ip:shell_ucs_subsystem:2.0 ulp_ucs
set_property -dict {CONFIG.HAS_HBM_CLK 3 CONFIG.NUM_SLR 2} [get_bd_cells ulp_ucs]
create_bd_cell -type ip -vlnv xilinx.com:ip:proc_sys_reset:5.0 proc_sys_reset_ctrl_slr0
create_bd_cell -type ip -vlnv xilinx.com:ip:proc_sys_reset:5.0 proc_sys_reset_ctrl_slr1
create_bd_cell -type ip -vlnv xilinx.com:ip:proc_sys_reset:5.0 proc_sys_reset_kernel_slr0
create_bd_cell -type ip -vlnv xilinx.com:ip:proc_sys_reset:5.0 proc_sys_reset_kernel_slr1
create_bd_cell -type ip -vlnv xilinx.com:ip:proc_sys_reset:5.0 proc_sys_reset_kernel2_slr0
create_bd_cell -type ip -vlnv xilinx.com:ip:proc_sys_reset:5.0 proc_sys_reset_kernel2_slr1
create_bd_cell -type hier interrupt_concat
create_bd_cell -type hier SLR0
create_bd_cell -type hier SLR1

# ---- hierarchy /interrupt_concat ----
current_bd_instance /interrupt_concat
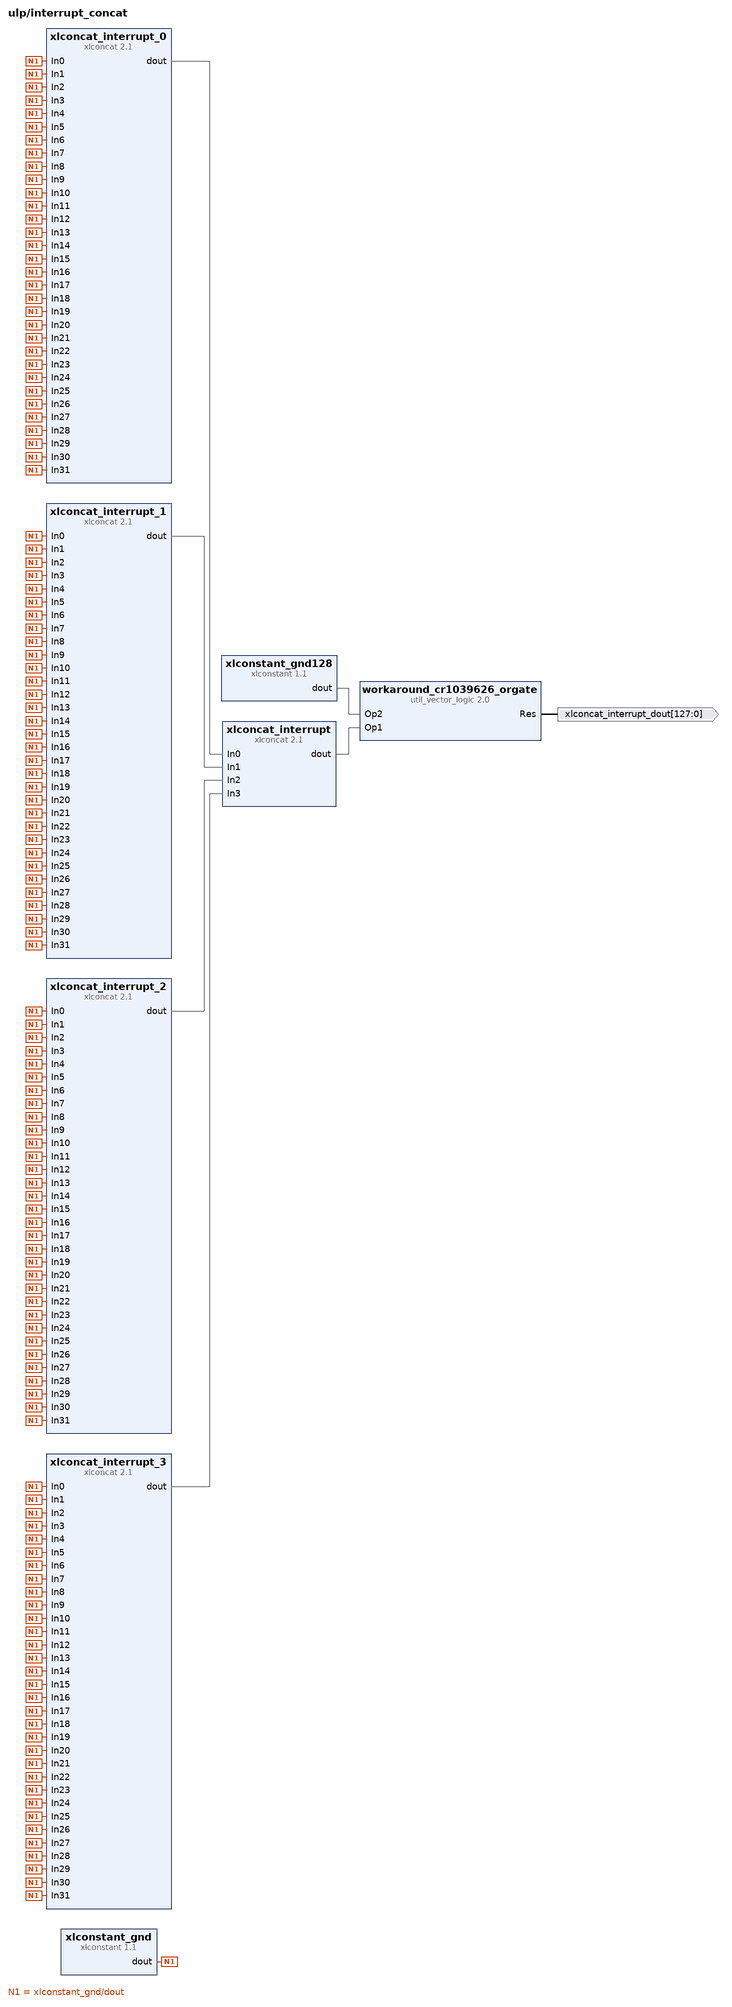
[diagram p5: block diagram inside /interrupt_concat]
create_bd_pin -dir O -from 127 -to 0 xlconcat_interrupt_dout

create_bd_cell -type ip -vlnv xilinx.com:ip:xlconcat:2.1 xlconcat_interrupt
set_property -dict {CONFIG.NUM_PORTS 4} [get_bd_cells xlconcat_interrupt]
create_bd_cell -type ip -vlnv xilinx.com:ip:xlconcat:2.1 xlconcat_interrupt_0
set_property -dict {CONFIG.NUM_PORTS 32} [get_bd_cells xlconcat_interrupt_0]
create_bd_cell -type ip -vlnv xilinx.com:ip:xlconcat:2.1 xlconcat_interrupt_1
set_property -dict {CONFIG.NUM_PORTS 32} [get_bd_cells xlconcat_interrupt_1]
create_bd_cell -type ip -vlnv xilinx.com:ip:xlconcat:2.1 xlconcat_interrupt_2
set_property -dict {CONFIG.NUM_PORTS 32} [get_bd_cells xlconcat_interrupt_2]
create_bd_cell -type ip -vlnv xilinx.com:ip:xlconcat:2.1 xlconcat_interrupt_3
set_property -dict {CONFIG.NUM_PORTS 32} [get_bd_cells xlconcat_interrupt_3]
create_bd_cell -type ip -vlnv xilinx.com:ip:xlconstant:1.1 xlconstant_gnd
set_property -dict {CONFIG.CONST_VAL 0} [get_bd_cells xlconstant_gnd]
create_bd_cell -type ip -vlnv xilinx.com:ip:util_vector_logic:2.0 workaround_cr1039626_orgate
set_property -dict {CONFIG.C_OPERATION or CONFIG.C_SIZE 128} [get_bd_cells workaround_cr1039626_orgate]
create_bd_cell -type ip -vlnv xilinx.com:ip:xlconstant:1.1 xlconstant_gnd128
set_property -dict {CONFIG.CONST_VAL 0 CONFIG.CONST_WIDTH 128} [get_bd_cells xlconstant_gnd128]

# ---- hierarchy /SLR0 ----
current_bd_instance /SLR0
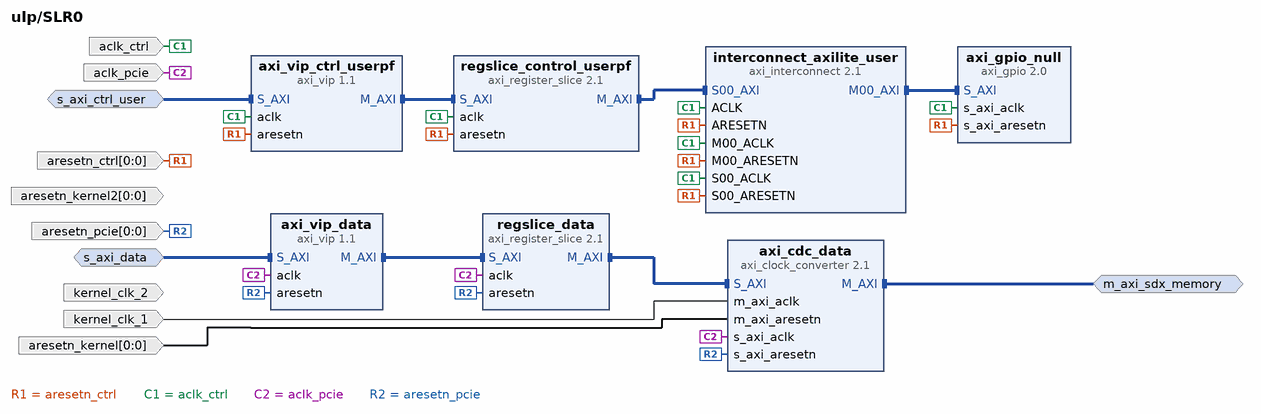
[diagram p6: block diagram inside /SLR0]
create_bd_intf_pin -mode Slave -vlnv xilinx.com:interface:aximm_rtl:1.0 s_axi_ctrl_user
create_bd_intf_pin -mode Slave -vlnv xilinx.com:interface:aximm_rtl:1.0 s_axi_data
create_bd_intf_pin -mode Master -vlnv xilinx.com:interface:aximm_rtl:1.0 m_axi_sdx_memory
create_bd_pin -dir I -type clk aclk_ctrl
create_bd_pin -dir I -type clk aclk_pcie
create_bd_pin -dir I -type clk kernel_clk_1
create_bd_pin -dir I -type clk kernel_clk_2
create_bd_pin -dir I -from 0 -to 0 -type rst aresetn_pcie
create_bd_pin -dir I -from 0 -to 0 -type rst aresetn_ctrl
create_bd_pin -dir I -from 0 -to 0 -type rst aresetn_kernel
create_bd_pin -dir I -from 0 -to 0 -type rst aresetn_kernel2

create_bd_cell -type ip -vlnv xilinx.com:ip:axi_gpio:2.0 axi_gpio_null
create_bd_cell -type ip -vlnv xilinx.com:ip:axi_vip:1.1 axi_vip_ctrl_userpf
create_bd_cell -type ip -vlnv xilinx.com:ip:axi_interconnect:2.1 interconnect_axilite_user
set_property -dict [list \
  CONFIG.M00_HAS_REGSLICE 4 \
  CONFIG.M01_HAS_REGSLICE 4 \
  CONFIG.M02_HAS_REGSLICE 4 \
  CONFIG.M03_HAS_REGSLICE 4 \
  CONFIG.M04_HAS_REGSLICE 4 \
  CONFIG.M05_HAS_REGSLICE 4 \
  CONFIG.M06_HAS_REGSLICE 4 \
  CONFIG.M07_HAS_REGSLICE 4 \
  CONFIG.M08_HAS_REGSLICE 4 \
  CONFIG.M09_HAS_REGSLICE 4 \
  CONFIG.M10_HAS_REGSLICE 4 \
  CONFIG.M11_HAS_REGSLICE 4 \
  CONFIG.M12_HAS_REGSLICE 4 \
  CONFIG.M13_HAS_REGSLICE 4 \
  CONFIG.M14_HAS_REGSLICE 4 \
  CONFIG.M15_HAS_REGSLICE 4 \
  CONFIG.M16_HAS_REGSLICE 4 \
  CONFIG.M17_HAS_REGSLICE 4 \
  CONFIG.M18_HAS_REGSLICE 4 \
  CONFIG.M19_HAS_REGSLICE 4 \
  CONFIG.M20_HAS_REGSLICE 4 \
  CONFIG.M21_HAS_REGSLICE 4 \
  CONFIG.M22_HAS_REGSLICE 4 \
  CONFIG.M23_HAS_REGSLICE 4 \
  CONFIG.M24_HAS_REGSLICE 4 \
  CONFIG.M25_HAS_REGSLICE 4 \
  CONFIG.M26_HAS_REGSLICE 4 \
  CONFIG.M27_HAS_REGSLICE 4 \
  CONFIG.M28_HAS_REGSLICE 4 \
  CONFIG.M29_HAS_REGSLICE 4 \
  CONFIG.M30_HAS_REGSLICE 4 \
  CONFIG.M31_HAS_REGSLICE 4 \
  CONFIG.M32_HAS_REGSLICE 4 \
  CONFIG.M33_HAS_REGSLICE 4 \
  CONFIG.M34_HAS_REGSLICE 4 \
  CONFIG.M35_HAS_REGSLICE 4 \
  CONFIG.M36_HAS_REGSLICE 4 \
  CONFIG.M37_HAS_REGSLICE 4 \
  CONFIG.M38_HAS_REGSLICE 4 \
  CONFIG.M39_HAS_REGSLICE 4 \
  CONFIG.M40_HAS_REGSLICE 4 \
  CONFIG.M41_HAS_REGSLICE 4 \
  CONFIG.M42_HAS_REGSLICE 4 \
  CONFIG.M43_HAS_REGSLICE 4 \
  CONFIG.M44_HAS_REGSLICE 4 \
  CONFIG.M45_HAS_REGSLICE 4 \
  CONFIG.M46_HAS_REGSLICE 4 \
  CONFIG.M47_HAS_REGSLICE 4 \
  CONFIG.M48_HAS_REGSLICE 4 \
  CONFIG.M49_HAS_REGSLICE 4 \
  CONFIG.M50_HAS_REGSLICE 4 \
  CONFIG.M51_HAS_REGSLICE 4 \
  CONFIG.M52_HAS_REGSLICE 4 \
  CONFIG.M53_HAS_REGSLICE 4 \
  CONFIG.M54_HAS_REGSLICE 4 \
  CONFIG.M55_HAS_REGSLICE 4 \
  CONFIG.M56_HAS_REGSLICE 4 \
  CONFIG.M57_HAS_REGSLICE 4 \
  CONFIG.M58_HAS_REGSLICE 4 \
  CONFIG.M59_HAS_REGSLICE 4 \
  CONFIG.M60_HAS_REGSLICE 4 \
  CONFIG.M61_HAS_REGSLICE 4 \
  CONFIG.M62_HAS_REGSLICE 4 \
  CONFIG.M63_HAS_REGSLICE 4 \
  CONFIG.NUM_MI 1 \
  CONFIG.S00_HAS_REGSLICE 4 \
  CONFIG.SLR_ASSIGNMENTS SLR0 \
] [get_bd_cells interconnect_axilite_user]
create_bd_cell -type ip -vlnv xilinx.com:ip:axi_register_slice:2.1 regslice_control_userpf
set_property -dict [list \
  CONFIG.ADDR_WIDTH 25 \
  CONFIG.DATA_WIDTH 32 \
  CONFIG.PROTOCOL AXI4LITE \
  CONFIG.READ_WRITE_MODE READ_WRITE \
  CONFIG.SLR_ASSIGNMENTS SLR0 \
] [get_bd_cells regslice_control_userpf]
create_bd_cell -type ip -vlnv xilinx.com:ip:axi_register_slice:2.1 regslice_data
set_property -dict [list \
  CONFIG.ADDR_WIDTH 39 \
  CONFIG.DATA_WIDTH 128 \
  CONFIG.ID_WIDTH 4 \
  CONFIG.PROTOCOL AXI4 \
  CONFIG.READ_WRITE_MODE READ_WRITE \
  CONFIG.REG_AR 1 \
  CONFIG.REG_AW 1 \
  CONFIG.REG_B 1 \
  CONFIG.REG_W 1 \
  CONFIG.SLR_ASSIGNMENTS SLR0 \
] [get_bd_cells regslice_data]
create_bd_cell -type ip -vlnv xilinx.com:ip:axi_clock_converter:2.1 axi_cdc_data
set_property -dict {CONFIG.SLR_ASSIGNMENTS SLR0} [get_bd_cells axi_cdc_data]
create_bd_cell -type ip -vlnv xilinx.com:ip:axi_vip:1.1 axi_vip_data

# ---- hierarchy /SLR1 ----
current_bd_instance /SLR1
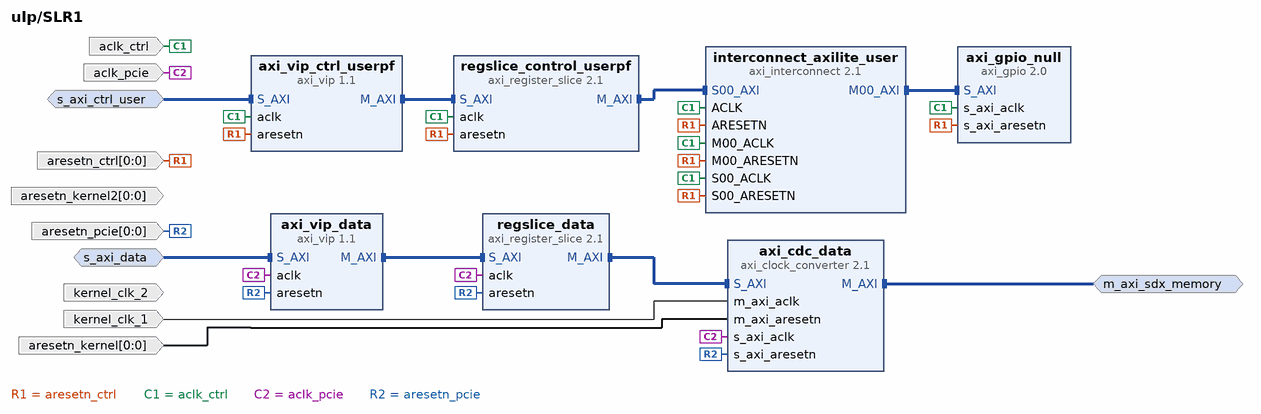
[diagram p7: block diagram inside /SLR1]
create_bd_intf_pin -mode Slave -vlnv xilinx.com:interface:aximm_rtl:1.0 s_axi_ctrl_user
create_bd_intf_pin -mode Slave -vlnv xilinx.com:interface:aximm_rtl:1.0 s_axi_data
create_bd_intf_pin -mode Master -vlnv xilinx.com:interface:aximm_rtl:1.0 m_axi_sdx_memory
create_bd_pin -dir I -type clk aclk_ctrl
create_bd_pin -dir I -type clk aclk_pcie
create_bd_pin -dir I -type clk kernel_clk_1
create_bd_pin -dir I -type clk kernel_clk_2
create_bd_pin -dir I -from 0 -to 0 -type rst aresetn_pcie
create_bd_pin -dir I -from 0 -to 0 -type rst aresetn_ctrl
create_bd_pin -dir I -from 0 -to 0 -type rst aresetn_kernel
create_bd_pin -dir I -from 0 -to 0 -type rst aresetn_kernel2

create_bd_cell -type ip -vlnv xilinx.com:ip:axi_gpio:2.0 axi_gpio_null
create_bd_cell -type ip -vlnv xilinx.com:ip:axi_vip:1.1 axi_vip_ctrl_userpf
create_bd_cell -type ip -vlnv xilinx.com:ip:axi_interconnect:2.1 interconnect_axilite_user
set_property -dict [list \
  CONFIG.M00_HAS_REGSLICE 4 \
  CONFIG.M01_HAS_REGSLICE 4 \
  CONFIG.M02_HAS_REGSLICE 4 \
  CONFIG.M03_HAS_REGSLICE 4 \
  CONFIG.M04_HAS_REGSLICE 4 \
  CONFIG.M05_HAS_REGSLICE 4 \
  CONFIG.M06_HAS_REGSLICE 4 \
  CONFIG.M07_HAS_REGSLICE 4 \
  CONFIG.M08_HAS_REGSLICE 4 \
  CONFIG.M09_HAS_REGSLICE 4 \
  CONFIG.M10_HAS_REGSLICE 4 \
  CONFIG.M11_HAS_REGSLICE 4 \
  CONFIG.M12_HAS_REGSLICE 4 \
  CONFIG.M13_HAS_REGSLICE 4 \
  CONFIG.M14_HAS_REGSLICE 4 \
  CONFIG.M15_HAS_REGSLICE 4 \
  CONFIG.M16_HAS_REGSLICE 4 \
  CONFIG.M17_HAS_REGSLICE 4 \
  CONFIG.M18_HAS_REGSLICE 4 \
  CONFIG.M19_HAS_REGSLICE 4 \
  CONFIG.M20_HAS_REGSLICE 4 \
  CONFIG.M21_HAS_REGSLICE 4 \
  CONFIG.M22_HAS_REGSLICE 4 \
  CONFIG.M23_HAS_REGSLICE 4 \
  CONFIG.M24_HAS_REGSLICE 4 \
  CONFIG.M25_HAS_REGSLICE 4 \
  CONFIG.M26_HAS_REGSLICE 4 \
  CONFIG.M27_HAS_REGSLICE 4 \
  CONFIG.M28_HAS_REGSLICE 4 \
  CONFIG.M29_HAS_REGSLICE 4 \
  CONFIG.M30_HAS_REGSLICE 4 \
  CONFIG.M31_HAS_REGSLICE 4 \
  CONFIG.M32_HAS_REGSLICE 4 \
  CONFIG.M33_HAS_REGSLICE 4 \
  CONFIG.M34_HAS_REGSLICE 4 \
  CONFIG.M35_HAS_REGSLICE 4 \
  CONFIG.M36_HAS_REGSLICE 4 \
  CONFIG.M37_HAS_REGSLICE 4 \
  CONFIG.M38_HAS_REGSLICE 4 \
  CONFIG.M39_HAS_REGSLICE 4 \
  CONFIG.M40_HAS_REGSLICE 4 \
  CONFIG.M41_HAS_REGSLICE 4 \
  CONFIG.M42_HAS_REGSLICE 4 \
  CONFIG.M43_HAS_REGSLICE 4 \
  CONFIG.M44_HAS_REGSLICE 4 \
  CONFIG.M45_HAS_REGSLICE 4 \
  CONFIG.M46_HAS_REGSLICE 4 \
  CONFIG.M47_HAS_REGSLICE 4 \
  CONFIG.M48_HAS_REGSLICE 4 \
  CONFIG.M49_HAS_REGSLICE 4 \
  CONFIG.M50_HAS_REGSLICE 4 \
  CONFIG.M51_HAS_REGSLICE 4 \
  CONFIG.M52_HAS_REGSLICE 4 \
  CONFIG.M53_HAS_REGSLICE 4 \
  CONFIG.M54_HAS_REGSLICE 4 \
  CONFIG.M55_HAS_REGSLICE 4 \
  CONFIG.M56_HAS_REGSLICE 4 \
  CONFIG.M57_HAS_REGSLICE 4 \
  CONFIG.M58_HAS_REGSLICE 4 \
  CONFIG.M59_HAS_REGSLICE 4 \
  CONFIG.M60_HAS_REGSLICE 4 \
  CONFIG.M61_HAS_REGSLICE 4 \
  CONFIG.M62_HAS_REGSLICE 4 \
  CONFIG.M63_HAS_REGSLICE 4 \
  CONFIG.NUM_MI 1 \
  CONFIG.S00_HAS_REGSLICE 4 \
  CONFIG.SLR_ASSIGNMENTS SLR1 \
] [get_bd_cells interconnect_axilite_user]
create_bd_cell -type ip -vlnv xilinx.com:ip:axi_register_slice:2.1 regslice_control_userpf
set_property -dict [list \
  CONFIG.ADDR_WIDTH 25 \
  CONFIG.DATA_WIDTH 32 \
  CONFIG.PROTOCOL AXI4LITE \
  CONFIG.READ_WRITE_MODE READ_WRITE \
  CONFIG.SLR_ASSIGNMENTS SLR1 \
] [get_bd_cells regslice_control_userpf]
create_bd_cell -type ip -vlnv xilinx.com:ip:axi_register_slice:2.1 regslice_data
set_property -dict [list \
  CONFIG.ADDR_WIDTH 39 \
  CONFIG.DATA_WIDTH 128 \
  CONFIG.ID_WIDTH 4 \
  CONFIG.PROTOCOL AXI4 \
  CONFIG.READ_WRITE_MODE READ_WRITE \
  CONFIG.REG_AR 1 \
  CONFIG.REG_AW 1 \
  CONFIG.REG_B 1 \
  CONFIG.REG_W 1 \
  CONFIG.SLR_ASSIGNMENTS SLR1 \
] [get_bd_cells regslice_data]
create_bd_cell -type ip -vlnv xilinx.com:ip:axi_clock_converter:2.1 axi_cdc_data
set_property -dict {CONFIG.SLR_ASSIGNMENTS SLR1} [get_bd_cells axi_cdc_data]
create_bd_cell -type ip -vlnv xilinx.com:ip:axi_vip:1.1 axi_vip_data

# ---- connections ----

current_bd_instance /interrupt_concat
connect_bd_net [get_bd_pins xlconcat_interrupt_0/dout] [get_bd_pins xlconcat_interrupt/In0]
connect_bd_net [get_bd_pins xlconcat_interrupt_1/dout] [get_bd_pins xlconcat_interrupt/In1]
connect_bd_net [get_bd_pins xlconcat_interrupt_2/dout] [get_bd_pins xlconcat_interrupt/In2]
connect_bd_net [get_bd_pins xlconcat_interrupt_3/dout] [get_bd_pins xlconcat_interrupt/In3]
connect_bd_net [get_bd_pins xlconstant_gnd/dout] \
  [get_bd_pins xlconcat_interrupt_0/In0] [get_bd_pins xlconcat_interrupt_0/In1] [get_bd_pins xlconcat_interrupt_0/In2] \
  [get_bd_pins xlconcat_interrupt_0/In3] [get_bd_pins xlconcat_interrupt_0/In4] [get_bd_pins xlconcat_interrupt_0/In5] \
  [get_bd_pins xlconcat_interrupt_0/In6] [get_bd_pins xlconcat_interrupt_0/In7] [get_bd_pins xlconcat_interrupt_0/In8] \
  [get_bd_pins xlconcat_interrupt_0/In9] [get_bd_pins xlconcat_interrupt_0/In10] [get_bd_pins xlconcat_interrupt_0/In11] \
  [get_bd_pins xlconcat_interrupt_0/In12] [get_bd_pins xlconcat_interrupt_0/In13] [get_bd_pins xlconcat_interrupt_0/In14] \
  [get_bd_pins xlconcat_interrupt_0/In15] [get_bd_pins xlconcat_interrupt_0/In16] [get_bd_pins xlconcat_interrupt_0/In17] \
  [get_bd_pins xlconcat_interrupt_0/In18] [get_bd_pins xlconcat_interrupt_0/In19] [get_bd_pins xlconcat_interrupt_0/In20] \
  [get_bd_pins xlconcat_interrupt_0/In21] [get_bd_pins xlconcat_interrupt_0/In22] [get_bd_pins xlconcat_interrupt_0/In23] \
  [get_bd_pins xlconcat_interrupt_0/In24] [get_bd_pins xlconcat_interrupt_0/In25] [get_bd_pins xlconcat_interrupt_0/In26] \
  [get_bd_pins xlconcat_interrupt_0/In27] [get_bd_pins xlconcat_interrupt_0/In28] [get_bd_pins xlconcat_interrupt_0/In29] \
  [get_bd_pins xlconcat_interrupt_0/In30] [get_bd_pins xlconcat_interrupt_0/In31] [get_bd_pins xlconcat_interrupt_1/In0] \
  [get_bd_pins xlconcat_interrupt_1/In1] [get_bd_pins xlconcat_interrupt_1/In2] [get_bd_pins xlconcat_interrupt_1/In3] \
  [get_bd_pins xlconcat_interrupt_1/In4] [get_bd_pins xlconcat_interrupt_1/In5] [get_bd_pins xlconcat_interrupt_1/In6] \
  [get_bd_pins xlconcat_interrupt_1/In7] [get_bd_pins xlconcat_interrupt_1/In8] [get_bd_pins xlconcat_interrupt_1/In9] \
  [get_bd_pins xlconcat_interrupt_1/In10] [get_bd_pins xlconcat_interrupt_1/In11] [get_bd_pins xlconcat_interrupt_1/In12] \
  [get_bd_pins xlconcat_interrupt_1/In13] [get_bd_pins xlconcat_interrupt_1/In14] [get_bd_pins xlconcat_interrupt_1/In15] \
  [get_bd_pins xlconcat_interrupt_1/In16] [get_bd_pins xlconcat_interrupt_1/In17] [get_bd_pins xlconcat_interrupt_1/In18] \
  [get_bd_pins xlconcat_interrupt_1/In19] [get_bd_pins xlconcat_interrupt_1/In20] [get_bd_pins xlconcat_interrupt_1/In21] \
  [get_bd_pins xlconcat_interrupt_1/In22] [get_bd_pins xlconcat_interrupt_1/In23] [get_bd_pins xlconcat_interrupt_1/In24] \
  [get_bd_pins xlconcat_interrupt_1/In25] [get_bd_pins xlconcat_interrupt_1/In26] [get_bd_pins xlconcat_interrupt_1/In27] \
  [get_bd_pins xlconcat_interrupt_1/In28] [get_bd_pins xlconcat_interrupt_1/In29] [get_bd_pins xlconcat_interrupt_1/In30] \
  [get_bd_pins xlconcat_interrupt_1/In31] [get_bd_pins xlconcat_interrupt_2/In0] [get_bd_pins xlconcat_interrupt_2/In1] \
  [get_bd_pins xlconcat_interrupt_2/In2] [get_bd_pins xlconcat_interrupt_2/In3] [get_bd_pins xlconcat_interrupt_2/In4] \
  [get_bd_pins xlconcat_interrupt_2/In5] [get_bd_pins xlconcat_interrupt_2/In6] [get_bd_pins xlconcat_interrupt_2/In7] \
  [get_bd_pins xlconcat_interrupt_2/In8] [get_bd_pins xlconcat_interrupt_2/In9] [get_bd_pins xlconcat_interrupt_2/In10] \
  [get_bd_pins xlconcat_interrupt_2/In11] [get_bd_pins xlconcat_interrupt_2/In12] [get_bd_pins xlconcat_interrupt_2/In13] \
  [get_bd_pins xlconcat_interrupt_2/In14] [get_bd_pins xlconcat_interrupt_2/In15] [get_bd_pins xlconcat_interrupt_2/In16] \
  [get_bd_pins xlconcat_interrupt_2/In17] [get_bd_pins xlconcat_interrupt_2/In18] [get_bd_pins xlconcat_interrupt_2/In19] \
  [get_bd_pins xlconcat_interrupt_2/In20] [get_bd_pins xlconcat_interrupt_2/In21] [get_bd_pins xlconcat_interrupt_2/In22] \
  [get_bd_pins xlconcat_interrupt_2/In23] [get_bd_pins xlconcat_interrupt_2/In24] [get_bd_pins xlconcat_interrupt_2/In25] \
  [get_bd_pins xlconcat_interrupt_2/In26] [get_bd_pins xlconcat_interrupt_2/In27] [get_bd_pins xlconcat_interrupt_2/In28] \
  [get_bd_pins xlconcat_interrupt_2/In29] [get_bd_pins xlconcat_interrupt_2/In30] [get_bd_pins xlconcat_interrupt_2/In31] \
  [get_bd_pins xlconcat_interrupt_3/In0] [get_bd_pins xlconcat_interrupt_3/In1] [get_bd_pins xlconcat_interrupt_3/In2] \
  [get_bd_pins xlconcat_interrupt_3/In3] [get_bd_pins xlconcat_interrupt_3/In4] [get_bd_pins xlconcat_interrupt_3/In5] \
  [get_bd_pins xlconcat_interrupt_3/In6] [get_bd_pins xlconcat_interrupt_3/In7] [get_bd_pins xlconcat_interrupt_3/In8] \
  [get_bd_pins xlconcat_interrupt_3/In9] [get_bd_pins xlconcat_interrupt_3/In10] [get_bd_pins xlconcat_interrupt_3/In11] \
  [get_bd_pins xlconcat_interrupt_3/In12] [get_bd_pins xlconcat_interrupt_3/In13] [get_bd_pins xlconcat_interrupt_3/In14] \
  [get_bd_pins xlconcat_interrupt_3/In15] [get_bd_pins xlconcat_interrupt_3/In16] [get_bd_pins xlconcat_interrupt_3/In17] \
  [get_bd_pins xlconcat_interrupt_3/In18] [get_bd_pins xlconcat_interrupt_3/In19] [get_bd_pins xlconcat_interrupt_3/In20] \
  [get_bd_pins xlconcat_interrupt_3/In21] [get_bd_pins xlconcat_interrupt_3/In22] [get_bd_pins xlconcat_interrupt_3/In23] \
  [get_bd_pins xlconcat_interrupt_3/In24] [get_bd_pins xlconcat_interrupt_3/In25] [get_bd_pins xlconcat_interrupt_3/In26] \
  [get_bd_pins xlconcat_interrupt_3/In27] [get_bd_pins xlconcat_interrupt_3/In28] [get_bd_pins xlconcat_interrupt_3/In29] \
  [get_bd_pins xlconcat_interrupt_3/In30] [get_bd_pins xlconcat_interrupt_3/In31]
connect_bd_net [get_bd_pins xlconstant_gnd128/dout] [get_bd_pins workaround_cr1039626_orgate/Op2]
connect_bd_net [get_bd_pins workaround_cr1039626_orgate/Res] [get_bd_pins xlconcat_interrupt_dout]
connect_bd_net [get_bd_pins xlconcat_interrupt/dout] [get_bd_pins workaround_cr1039626_orgate/Op1]

current_bd_instance /SLR0
connect_bd_intf_net [get_bd_intf_pins axi_vip_data/M_AXI] [get_bd_intf_pins regslice_data/S_AXI]
connect_bd_intf_net [get_bd_intf_pins s_axi_data] [get_bd_intf_pins axi_vip_data/S_AXI]
connect_bd_intf_net [get_bd_intf_pins axi_vip_ctrl_userpf/M_AXI] [get_bd_intf_pins regslice_control_userpf/S_AXI]
connect_bd_intf_net [get_bd_intf_pins axi_cdc_data/S_AXI] [get_bd_intf_pins regslice_data/M_AXI]
connect_bd_intf_net [get_bd_intf_pins axi_gpio_null/S_AXI] [get_bd_intf_pins interconnect_axilite_user/M00_AXI]
connect_bd_intf_net [get_bd_intf_pins s_axi_ctrl_user] [get_bd_intf_pins axi_vip_ctrl_userpf/S_AXI]
connect_bd_intf_net [get_bd_intf_pins m_axi_sdx_memory] [get_bd_intf_pins axi_cdc_data/M_AXI]
connect_bd_intf_net [get_bd_intf_pins interconnect_axilite_user/S00_AXI] [get_bd_intf_pins regslice_control_userpf/M_AXI]
connect_bd_net [get_bd_pins aresetn_ctrl] \
  [get_bd_pins axi_gpio_null/s_axi_aresetn] [get_bd_pins axi_vip_ctrl_userpf/aresetn] \
  [get_bd_pins interconnect_axilite_user/ARESETN] [get_bd_pins interconnect_axilite_user/M00_ARESETN] \
  [get_bd_pins interconnect_axilite_user/S00_ARESETN] [get_bd_pins regslice_control_userpf/aresetn]
connect_bd_net [get_bd_pins aclk_ctrl] \
  [get_bd_pins axi_gpio_null/s_axi_aclk] [get_bd_pins axi_vip_ctrl_userpf/aclk] [get_bd_pins interconnect_axilite_user/ACLK] \
  [get_bd_pins interconnect_axilite_user/M00_ACLK] [get_bd_pins interconnect_axilite_user/S00_ACLK] \
  [get_bd_pins regslice_control_userpf/aclk]
connect_bd_net -net kernel_clk_1_1 [get_bd_pins kernel_clk_1] [get_bd_pins axi_cdc_data/m_axi_aclk]
connect_bd_net [get_bd_pins aclk_pcie] [get_bd_pins axi_cdc_data/s_axi_aclk] [get_bd_pins axi_vip_data/aclk] [get_bd_pins regslice_data/aclk]
connect_bd_net [get_bd_pins aresetn_pcie] \
  [get_bd_pins axi_cdc_data/s_axi_aresetn] [get_bd_pins axi_vip_data/aresetn] [get_bd_pins regslice_data/aresetn]
connect_bd_net [get_bd_pins aresetn_kernel] [get_bd_pins axi_cdc_data/m_axi_aresetn]
set_property PFM.AXI_PORT {M01_AXI {memport "M_AXI_GP"} M02_AXI {memport "M_AXI_GP"} M03_AXI {memport "M_AXI_GP"} M04_AXI {memport "M_AXI_GP"} M05_AXI {memport "M_AXI_GP"} M06_AXI {memport "M_AXI_GP"} M07_AXI {memport "M_AXI_GP"} M08_AXI {memport "M_AXI_GP"} M09_AXI {memport "M_AXI_GP"} M10_AXI {memport "M_AXI_GP"} M11_AXI {memport "M_AXI_GP"} M12_AXI {memport "M_AXI_GP"} M13_AXI {memport "M_AXI_GP"} M14_AXI {memport "M_AXI_GP"} M15_AXI {memport "M_AXI_GP"} M16_AXI {memport "M_AXI_GP"} M17_AXI {memport "M_AXI_GP"} M18_AXI {memport "M_AXI_GP"} M19_AXI {memport "M_AXI_GP"} M20_AXI {memport "M_AXI_GP"} M21_AXI {memport "M_AXI_GP"} M22_AXI {memport "M_AXI_GP"} M23_AXI {memport "M_AXI_GP"} M24_AXI {memport "M_AXI_GP"} M25_AXI {memport "M_AXI_GP"} M26_AXI {memport "M_AXI_GP"} M27_AXI {memport "M_AXI_GP"} M28_AXI {memport "M_AXI_GP"} M29_AXI {memport "M_AXI_GP"} M30_AXI {memport "M_AXI_GP"}} [get_bd_cells interconnect_axilite_user]

current_bd_instance /SLR1
connect_bd_intf_net [get_bd_intf_pins interconnect_axilite_user/S00_AXI] [get_bd_intf_pins regslice_control_userpf/M_AXI]
connect_bd_intf_net [get_bd_intf_pins m_axi_sdx_memory] [get_bd_intf_pins axi_cdc_data/M_AXI]
connect_bd_intf_net [get_bd_intf_pins s_axi_ctrl_user] [get_bd_intf_pins axi_vip_ctrl_userpf/S_AXI]
connect_bd_intf_net [get_bd_intf_pins axi_gpio_null/S_AXI] [get_bd_intf_pins interconnect_axilite_user/M00_AXI]
connect_bd_intf_net [get_bd_intf_pins axi_cdc_data/S_AXI] [get_bd_intf_pins regslice_data/M_AXI]
connect_bd_intf_net [get_bd_intf_pins axi_vip_ctrl_userpf/M_AXI] [get_bd_intf_pins regslice_control_userpf/S_AXI]
connect_bd_intf_net [get_bd_intf_pins s_axi_data] [get_bd_intf_pins axi_vip_data/S_AXI]
connect_bd_intf_net [get_bd_intf_pins axi_vip_data/M_AXI] [get_bd_intf_pins regslice_data/S_AXI]
connect_bd_net [get_bd_pins aresetn_ctrl] \
  [get_bd_pins axi_gpio_null/s_axi_aresetn] [get_bd_pins axi_vip_ctrl_userpf/aresetn] \
  [get_bd_pins interconnect_axilite_user/ARESETN] [get_bd_pins interconnect_axilite_user/M00_ARESETN] \
  [get_bd_pins interconnect_axilite_user/S00_ARESETN] [get_bd_pins regslice_control_userpf/aresetn]
connect_bd_net [get_bd_pins aclk_ctrl] \
  [get_bd_pins axi_gpio_null/s_axi_aclk] [get_bd_pins axi_vip_ctrl_userpf/aclk] [get_bd_pins interconnect_axilite_user/ACLK] \
  [get_bd_pins interconnect_axilite_user/M00_ACLK] [get_bd_pins interconnect_axilite_user/S00_ACLK] \
  [get_bd_pins regslice_control_userpf/aclk]
connect_bd_net -net kernel_clk_1_1 [get_bd_pins kernel_clk_1] [get_bd_pins axi_cdc_data/m_axi_aclk]
connect_bd_net [get_bd_pins aclk_pcie] [get_bd_pins axi_cdc_data/s_axi_aclk] [get_bd_pins axi_vip_data/aclk] [get_bd_pins regslice_data/aclk]
connect_bd_net [get_bd_pins aresetn_pcie] \
  [get_bd_pins axi_cdc_data/s_axi_aresetn] [get_bd_pins axi_vip_data/aresetn] [get_bd_pins regslice_data/aresetn]
connect_bd_net [get_bd_pins aresetn_kernel] [get_bd_pins axi_cdc_data/m_axi_aresetn]
set_property PFM.AXI_PORT {M01_AXI {memport "M_AXI_GP"} M02_AXI {memport "M_AXI_GP"} M03_AXI {memport "M_AXI_GP"} M04_AXI {memport "M_AXI_GP"} M05_AXI {memport "M_AXI_GP"} M06_AXI {memport "M_AXI_GP"} M07_AXI {memport "M_AXI_GP"} M08_AXI {memport "M_AXI_GP"} M09_AXI {memport "M_AXI_GP"} M10_AXI {memport "M_AXI_GP"} M11_AXI {memport "M_AXI_GP"} M12_AXI {memport "M_AXI_GP"} M13_AXI {memport "M_AXI_GP"} M14_AXI {memport "M_AXI_GP"} M15_AXI {memport "M_AXI_GP"} M16_AXI {memport "M_AXI_GP"} M17_AXI {memport "M_AXI_GP"} M18_AXI {memport "M_AXI_GP"} M19_AXI {memport "M_AXI_GP"} M20_AXI {memport "M_AXI_GP"} M21_AXI {memport "M_AXI_GP"} M22_AXI {memport "M_AXI_GP"} M23_AXI {memport "M_AXI_GP"} M24_AXI {memport "M_AXI_GP"} M25_AXI {memport "M_AXI_GP"} M26_AXI {memport "M_AXI_GP"} M27_AXI {memport "M_AXI_GP"} M28_AXI {memport "M_AXI_GP"} M29_AXI {memport "M_AXI_GP"} M30_AXI {memport "M_AXI_GP"} M31_AXI {memport "M_AXI_GP"} M32_AXI {memport "M_AXI_GP"} M33_AXI {memport "M_AXI_GP"} M34_AXI {memport "M_AXI_GP"} M35_AXI {memport "M_AXI_GP"} M36_AXI {memport "M_AXI_GP"} M37_AXI {memport "M_AXI_GP"} M38_AXI {memport "M_AXI_GP"} M39_AXI {memport "M_AXI_GP"} M40_AXI {memport "M_AXI_GP"} M41_AXI {memport "M_AXI_GP"} M42_AXI {memport "M_AXI_GP"} M43_AXI {memport "M_AXI_GP"} M44_AXI {memport "M_AXI_GP"} M45_AXI {memport "M_AXI_GP"} M46_AXI {memport "M_AXI_GP"} M47_AXI {memport "M_AXI_GP"} M48_AXI {memport "M_AXI_GP"} M49_AXI {memport "M_AXI_GP"} M50_AXI {memport "M_AXI_GP"} M51_AXI {memport "M_AXI_GP"} M52_AXI {memport "M_AXI_GP"} M53_AXI {memport "M_AXI_GP"} M54_AXI {memport "M_AXI_GP"} M55_AXI {memport "M_AXI_GP"} M56_AXI {memport "M_AXI_GP"} M57_AXI {memport "M_AXI_GP"} M58_AXI {memport "M_AXI_GP"} M59_AXI {memport "M_AXI_GP"} M60_AXI {memport "M_AXI_GP"} M61_AXI {memport "M_AXI_GP"} M62_AXI {memport "M_AXI_GP"}} [get_bd_cells interconnect_axilite_user]

current_bd_instance /
connect_bd_intf_net -intf_net BLP_S_AXI_CTRL_USER_00_1 [get_bd_intf_ports BLP_S_AXI_CTRL_USER_00] [get_bd_intf_pins ii_level0_wire/BLP_S_AXI_CTRL_USER_00]
connect_bd_intf_net -intf_net BLP_S_AXI_CTRL_MGMT_00_1 [get_bd_intf_ports BLP_S_AXI_CTRL_MGMT_00] [get_bd_intf_pins ii_level0_wire/BLP_S_AXI_CTRL_MGMT_00]
connect_bd_intf_net -intf_net BLP_S_AXI_CTRL_MGMT_01_1 [get_bd_intf_ports BLP_S_AXI_CTRL_MGMT_01] [get_bd_intf_pins ii_level0_wire/BLP_S_AXI_CTRL_MGMT_01]
connect_bd_intf_net -intf_net BLP_S_AXI_DATA_H2C_00_1 [get_bd_intf_ports BLP_S_AXI_DATA_H2C_00] [get_bd_intf_pins ii_level0_wire/BLP_S_AXI_DATA_H2C_00]
connect_bd_intf_net -intf_net BLP_S_AXI_CTRL_USER_02_1 [get_bd_intf_ports BLP_S_AXI_CTRL_USER_02] [get_bd_intf_pins ii_level0_wire/BLP_S_AXI_CTRL_USER_02]
connect_bd_intf_net -intf_net BLP_S_AXI_CTRL_USER_01_1 [get_bd_intf_ports BLP_S_AXI_CTRL_USER_01] [get_bd_intf_pins ii_level0_wire/BLP_S_AXI_CTRL_USER_01]
connect_bd_intf_net [get_bd_intf_pins SLR1/s_axi_ctrl_user] [get_bd_intf_pins ii_level0_wire/ULP_M_AXI_CTRL_USER_01]
connect_bd_intf_net [get_bd_intf_pins SLR1/m_axi_sdx_memory] [get_bd_intf_pins memory_subsystem/S01_AXI]
connect_bd_intf_net [get_bd_intf_pins axi_data_sc/M00_AXI] [get_bd_intf_pins hmss_0/S00_AXI]
connect_bd_intf_net [get_bd_intf_pins ii_level0_wire/ULP_M_AXI_CTRL_USER_02] [get_bd_intf_pins user_debug_bridge/S_AXI]
connect_bd_intf_net [get_bd_intf_pins ii_level0_wire/ULP_M_AXI_CTRL_MGMT_01] [get_bd_intf_pins ulp_ucs/s_axi_ctrl_mgmt]
connect_bd_intf_net [get_bd_intf_pins SLR0/m_axi_sdx_memory] [get_bd_intf_pins memory_subsystem/S00_AXI]
connect_bd_intf_net [get_bd_intf_pins ii_level0_wire/ULP_M_AXI_CTRL_MGMT_00] [get_bd_intf_pins hmss_0/S_AXI_CTRL]
connect_bd_intf_net [get_bd_intf_pins debug_bridge_xsdbm/S_BSCAN] [get_bd_intf_pins user_debug_bridge/m0_bscan]
connect_bd_intf_net [get_bd_intf_pins axi_data_sc/M01_AXI] [get_bd_intf_pins SLR0/s_axi_data]
connect_bd_intf_net [get_bd_intf_pins axi_vip_data/S_AXI] [get_bd_intf_pins ii_level0_wire/ULP_M_AXI_DATA_H2C_00]
connect_bd_intf_net [get_bd_intf_pins SLR1/s_axi_data] [get_bd_intf_pins axi_data_sc/M02_AXI]
connect_bd_intf_net [get_bd_intf_pins axi_vip_data/M_AXI] [get_bd_intf_pins axi_data_sc/S00_AXI]
connect_bd_intf_net [get_bd_intf_pins SLR0/s_axi_ctrl_user] [get_bd_intf_pins ii_level0_wire/ULP_M_AXI_CTRL_USER_00]
connect_bd_net [get_bd_pins ii_level0_wire/blp_m_data_hbm_temp_00] [get_bd_ports blp_m_data_hbm_temp_00]
connect_bd_net [get_bd_pins ii_level0_wire/blp_m_data_hbm_temp_01] [get_bd_ports blp_m_data_hbm_temp_01]
connect_bd_net [get_bd_pins ii_level0_wire/blp_m_data_memory_calib_complete_00] [get_bd_ports blp_m_data_memory_calib_complete_00]
connect_bd_net [get_bd_pins ii_level0_wire/blp_m_irq_cu_00] [get_bd_ports blp_m_irq_cu_00]
connect_bd_net [get_bd_pins ii_level0_wire/blp_m_irq_hbm_cattrip_00] [get_bd_ports blp_m_irq_hbm_cattrip_00]
connect_bd_net -net blp_s_aclk_ctrl_00_1 [get_bd_ports blp_s_aclk_ctrl_00] [get_bd_pins ii_level0_wire/blp_s_aclk_ctrl_00]
connect_bd_net -net blp_s_aclk_freerun_ref_00_1 [get_bd_ports blp_s_aclk_freerun_ref_00] [get_bd_pins ii_level0_wire/blp_s_aclk_freerun_ref_00]
connect_bd_net -net blp_s_aclk_pcie_00_1 [get_bd_ports blp_s_aclk_pcie_00] [get_bd_pins ii_level0_wire/blp_s_aclk_pcie_00]
connect_bd_net -net blp_s_aresetn_ctrl_00_1 [get_bd_ports blp_s_aresetn_ctrl_00] [get_bd_pins ii_level0_wire/blp_s_aresetn_ctrl_00]
connect_bd_net -net blp_s_aresetn_pcie_00_1 [get_bd_ports blp_s_aresetn_pcie_00] [get_bd_pins ii_level0_wire/blp_s_aresetn_pcie_00]
connect_bd_net -net blp_s_data_satellite_ctrl_data_00_1 [get_bd_ports blp_s_data_satellite_ctrl_data_00] \
  [get_bd_pins ii_level0_wire/blp_s_data_satellite_ctrl_data_00]
connect_bd_net [get_bd_pins ulp_ucs/clk_kernel] [get_bd_ports clk_kernel_out]
connect_bd_net [get_bd_pins ulp_ucs/clk_kernel2] [get_bd_ports clk_kernel2_out]
connect_bd_net [get_bd_pins ulp_ucs/hbm_aclk] [get_bd_ports hbm_aclk_out]
connect_bd_net [get_bd_ports hbm_aclk_in] [get_bd_pins hmss_0/hbm_aclk]
connect_bd_net [get_bd_ports clk_kernel_in] \
  [get_bd_pins SLR0/kernel_clk_1] [get_bd_pins SLR1/kernel_clk_1] [get_bd_pins proc_sys_reset_kernel_slr0/slowest_sync_clk] \
  [get_bd_pins proc_sys_reset_kernel_slr1/slowest_sync_clk] [get_bd_pins memory_subsystem/aclk]
connect_bd_net [get_bd_ports clk_kernel2_in] \
  [get_bd_pins SLR0/kernel_clk_2] [get_bd_pins SLR1/kernel_clk_2] [get_bd_pins proc_sys_reset_kernel2_slr0/slowest_sync_clk] \
  [get_bd_pins proc_sys_reset_kernel2_slr1/slowest_sync_clk]
connect_bd_net [get_bd_pins ulp_ucs/aresetn_kernel_slr0] [get_bd_pins proc_sys_reset_kernel_slr0/ext_reset_in]
connect_bd_net [get_bd_pins ulp_ucs/aresetn_kernel_slr1] [get_bd_pins proc_sys_reset_kernel_slr1/ext_reset_in]
connect_bd_net [get_bd_pins ulp_ucs/aresetn_kernel2_slr0] [get_bd_pins proc_sys_reset_kernel2_slr0/ext_reset_in]
connect_bd_net [get_bd_pins ulp_ucs/aresetn_kernel2_slr1] [get_bd_pins proc_sys_reset_kernel2_slr1/ext_reset_in]
connect_bd_net [get_bd_pins ulp_ucs/aresetn_ctrl_slr0] [get_bd_pins proc_sys_reset_ctrl_slr0/ext_reset_in]
connect_bd_net [get_bd_pins ulp_ucs/aresetn_ctrl_slr1] [get_bd_pins proc_sys_reset_ctrl_slr1/ext_reset_in]
connect_bd_net [get_bd_pins ulp_ucs/hbm_aresetn] [get_bd_pins hmss_0/hbm_aresetn]
connect_bd_net [get_bd_pins ii_level0_wire/ulp_m_aclk_ctrl_00] \
  [get_bd_pins ulp_ucs/aclk_ctrl] [get_bd_pins SLR0/aclk_ctrl] [get_bd_pins SLR1/aclk_ctrl] [get_bd_pins hmss_0/ctrl_aclk] \
  [get_bd_pins memory_subsystem/aclk1] [get_bd_pins user_debug_bridge/s_axi_aclk] [get_bd_pins debug_bridge_xsdbm/clk] \
  [get_bd_pins proc_sys_reset_ctrl_slr0/slowest_sync_clk] [get_bd_pins proc_sys_reset_ctrl_slr1/slowest_sync_clk]
connect_bd_net [get_bd_pins ii_level0_wire/ulp_m_aclk_pcie_00] \
  [get_bd_pins ulp_ucs/aclk_pcie] [get_bd_pins SLR0/aclk_pcie] [get_bd_pins SLR1/aclk_pcie] [get_bd_pins hmss_0/aclk] \
  [get_bd_pins axi_data_sc/aclk] [get_bd_pins axi_vip_data/aclk]
connect_bd_net [get_bd_pins ii_level0_wire/ulp_m_aclk_freerun_ref_00] \
  [get_bd_pins ulp_ucs/freerun_refclk] [get_bd_pins hmss_0/hbm_ref_clk] [get_bd_pins ulp_ucs/hbm_refclk]
connect_bd_net [get_bd_pins ii_level0_wire/ulp_m_aresetn_ctrl_00] [get_bd_pins ulp_ucs/aresetn_ctrl] [get_bd_pins user_debug_bridge/s_axi_aresetn]
connect_bd_net [get_bd_pins ii_level0_wire/ulp_m_aresetn_pcie_00] [get_bd_pins ulp_ucs/aresetn_pcie]
connect_bd_net [get_bd_pins ii_level0_wire/ulp_m_data_satellite_ctrl_data_00] [get_bd_pins satellite_gpio_slice_1/Din]
connect_bd_net [get_bd_pins satellite_gpio_slice_1/Dout] [get_bd_pins ulp_ucs/shutdown_clocks]
connect_bd_net [get_bd_pins proc_sys_reset_ctrl_slr0/peripheral_aresetn] [get_bd_pins SLR0/aresetn_ctrl] [get_bd_pins hmss_0/ctrl_aresetn]
connect_bd_net [get_bd_pins proc_sys_reset_ctrl_slr1/peripheral_aresetn] [get_bd_pins SLR1/aresetn_ctrl]
connect_bd_net [get_bd_pins ulp_ucs/aresetn_pcie_slr0] \
  [get_bd_pins SLR0/aresetn_pcie] [get_bd_pins axi_data_sc/aresetn] [get_bd_pins axi_vip_data/aresetn] \
  [get_bd_pins memory_subsystem/aresetn] [get_bd_pins hmss_0/aresetn]
connect_bd_net [get_bd_pins ulp_ucs/aresetn_pcie_slr1] [get_bd_pins SLR1/aresetn_pcie]
connect_bd_net [get_bd_pins proc_sys_reset_kernel_slr0/peripheral_aresetn] [get_bd_pins SLR0/aresetn_kernel]
connect_bd_net [get_bd_pins proc_sys_reset_kernel2_slr0/peripheral_aresetn] [get_bd_pins SLR0/aresetn_kernel2]
connect_bd_net [get_bd_pins proc_sys_reset_kernel_slr1/peripheral_aresetn] [get_bd_pins SLR1/aresetn_kernel]
connect_bd_net [get_bd_pins proc_sys_reset_kernel2_slr1/peripheral_aresetn] [get_bd_pins SLR1/aresetn_kernel2]
connect_bd_net [get_bd_pins interrupt_concat/xlconcat_interrupt_dout] [get_bd_pins ii_level0_wire/ulp_s_irq_cu_00]
connect_bd_net [get_bd_pins hmss_0/hbm_mc_init_seq_complete] [get_bd_pins ii_level0_wire/ulp_s_data_memory_calib_complete_00]
connect_bd_net [get_bd_pins hmss_0/DRAM_STAT_CATTRIP] [get_bd_pins ii_level0_wire/ulp_s_irq_hbm_cattrip_00]
connect_bd_net [get_bd_pins hmss_0/DRAM_0_STAT_TEMP] [get_bd_pins ii_level0_wire/ulp_s_data_hbm_temp_00]
connect_bd_net [get_bd_pins hmss_0/DRAM_1_STAT_TEMP] [get_bd_pins ii_level0_wire/ulp_s_data_hbm_temp_01]
set_property PFM.MEMSS {PLRAM {  PLRAM_MEM00 "auto true"  PLRAM_MEM01 "auto true"  PLRAM_MEM02 "auto true"  PLRAM_MEM03 "auto true"  }  } [get_bd_cells memory_subsystem]
